# EAGLE design board (EAGLE 7.4.0)
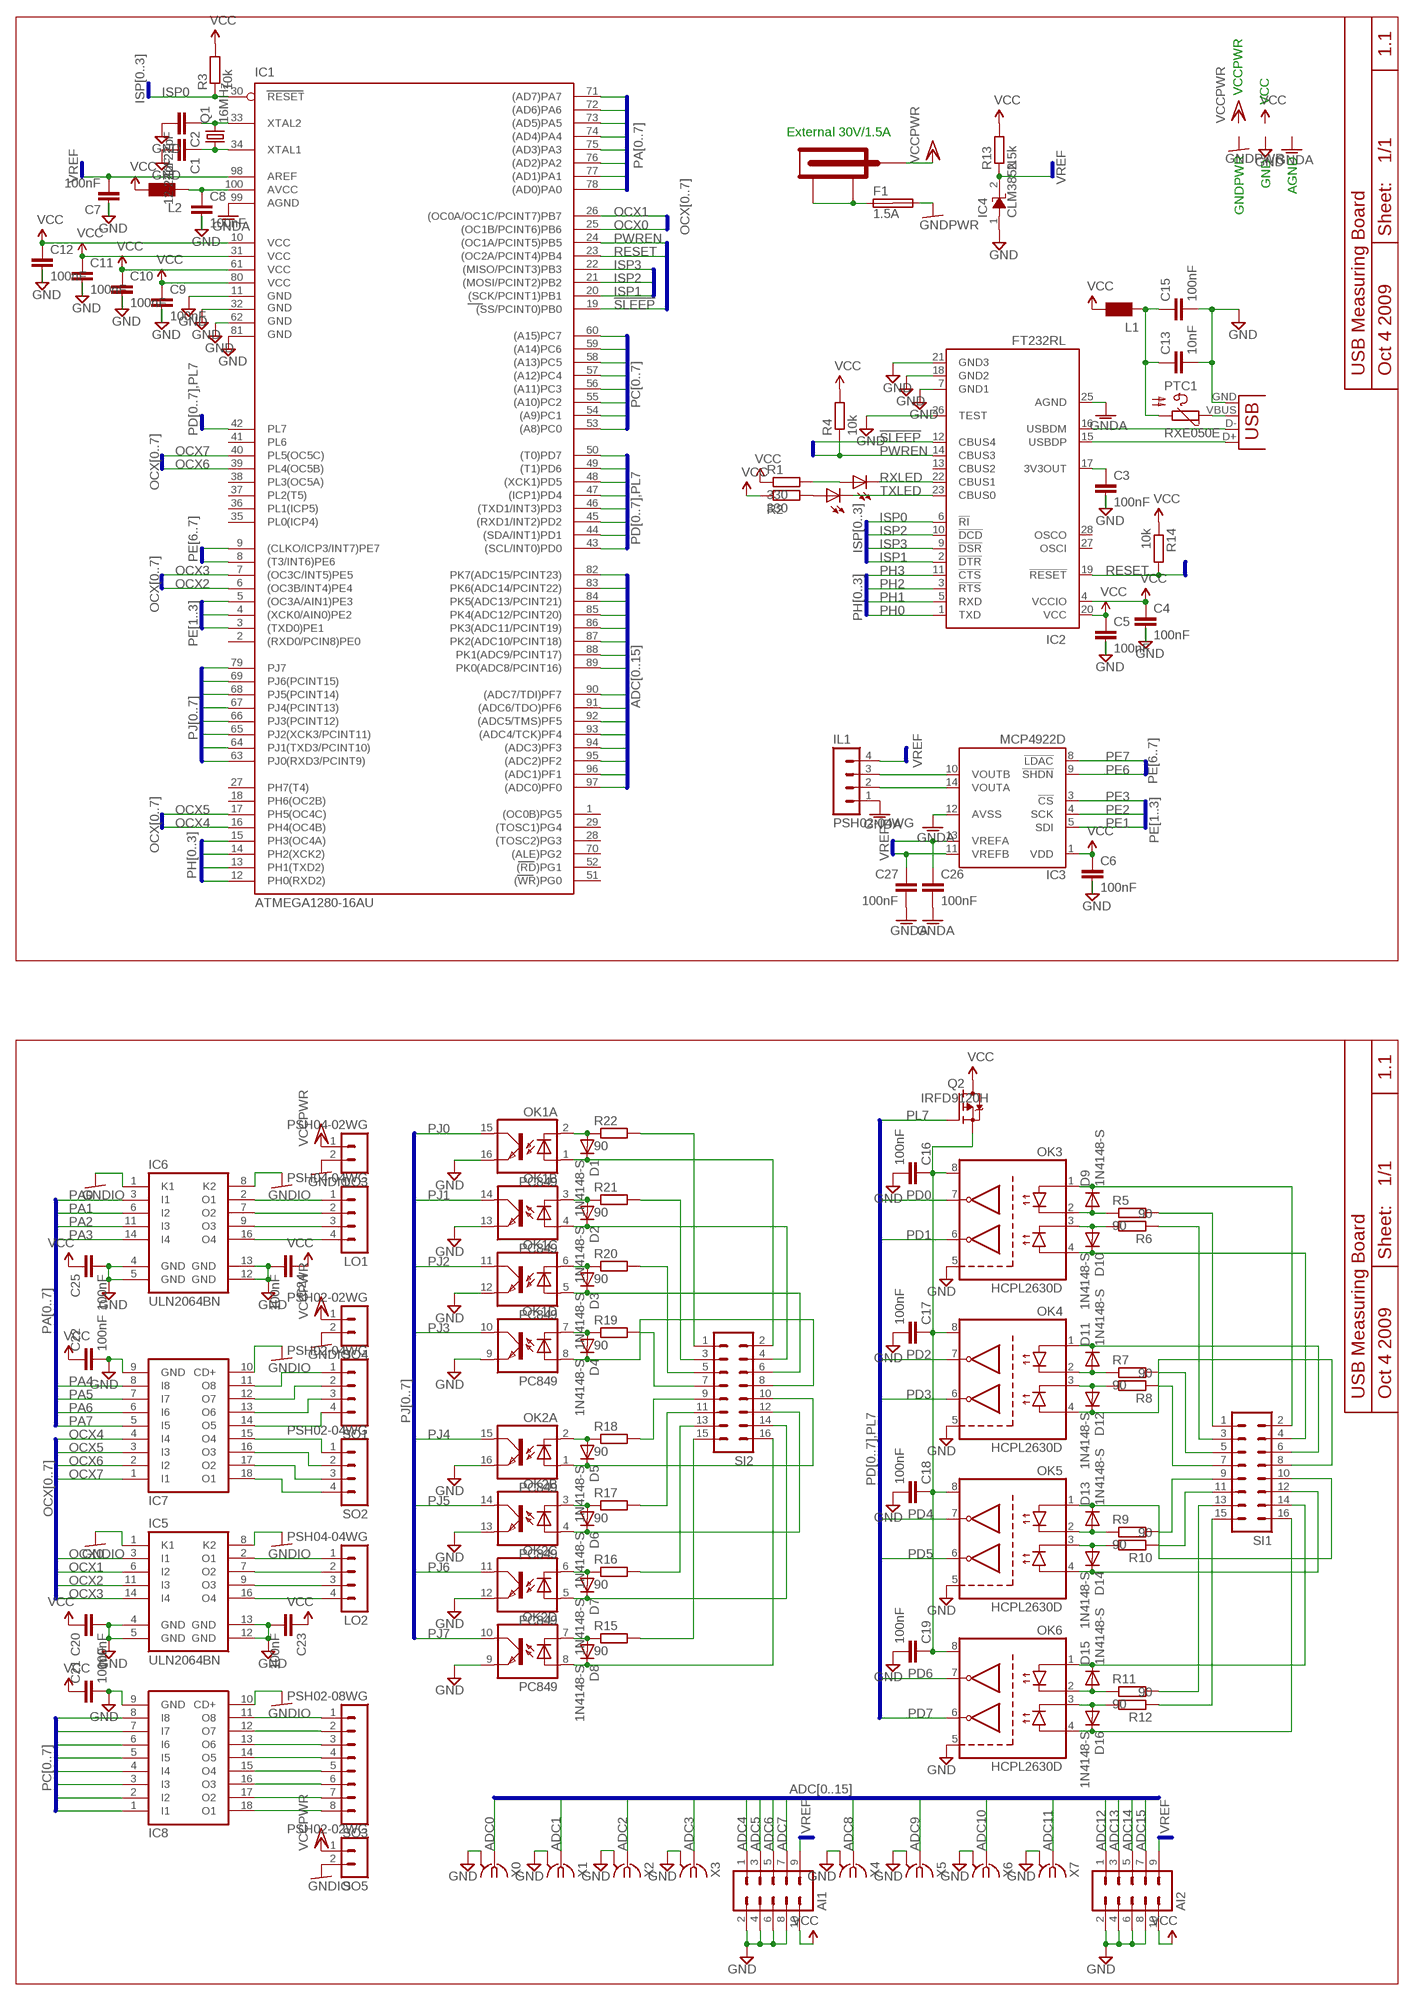
[diagram p0: schematic, sheet 1]

## Parts
AI1  ML10  [ML10]
AI2  ML10  [ML10]
C1  12-22pF  C-EUC0805K  [C0805K]
C2  12-22pF  C-EUC0805K  [C0805K]
C3  100nF  C-EUC0805K  [C0805K]
C4  100nF  C-EUC0805K  [C0805K]
C5  100nF  C-EUC0805K  [C0805K]
C6  100nF  C-EUC0805K  [C0805K]
C7  100nF  C-EUC0805K  [C0805K]
C8  100nF  C-EUC0805K  [C0805K]
C9  100nF  C-EUC0805K  [C0805K]
C10  100nF  C-EUC0805K  [C0805K]
C11  100nF  C-EUC0805K  [C0805K]
C12  100nF  C-EUC0805K  [C0805K]
C13  10nF  C-EUC0805K  [C0805K]
C15  100nF  C-EUC0805K  [C0805K]
C16  100nF  C-EUC0805K  [C0805K]
C17  100nF  C-EUC0805K  [C0805K]
C18  100nF  C-EUC0805K  [C0805K]
C19  100nF  C-EUC0805K  [C0805K]
C20  100nF  C-EUC0805K  [C0805K]
C21  100nF  C-EUC0805K  [C0805K]
C22  100nF  C-EUC0805K  [C0805K]
C23  100nF  C-EUC0805K  [C0805K]
C24  100nF  C-EUC0805K  [C0805K]
C25  100nF  C-EUC0805K  [C0805K]
C26  100nF  C-EUC0805K  [C0805K]
C27  100nF  C-EUC0805K  [C0805K]
CON1  PWR-PCB  [PWR]
D1  1N4148-S  [D0805]
D2  1N4148-S  [D0805]
D3  1N4148-S  [D0805]
D4  1N4148-S  [D0805]
D5  1N4148-S  [D0805]
D6  1N4148-S  [D0805]
D7  1N4148-S  [D0805]
D8  1N4148-S  [D0805]
D9  1N4148-S  [D0805]
D10  1N4148-S  [D0805]
D11  1N4148-S  [D0805]
D12  1N4148-S  [D0805]
D13  1N4148-S  [D0805]
D14  1N4148-S  [D0805]
D15  1N4148-S  [D0805]
D16  1N4148-S  [D0805]
F1  1.5A  FUSE-TH  [FUSE-TH]
IC1  ATMEGA1280-16AU  ATMEGA640-16AU  [TQFP100]
IC2  FT232RL  [SSOP-28]
IC3  MCP4922D  [DIL-14]
IC4  CLM385N  [TO-92]
IC5  ULN2064BN  [DIL16]
IC6  ULN2064BN  [DIL16]
IC7  ULN2803A  [DIL18]
IC8  ULN2803A  [DIL18]
IL1  PSH02-04WG  [PSH02-04WG]
L1  FB-TH  [FB-2]
L2  FB-TH  [FB-2]
LO1  PSH04-04WG  [PSH04-04WG]
LO2  PSH04-04WG  [PSH04-04WG]
LO3  PSH04-02WG  [PSH04-02WG]
OK1  PC849  [DIL-16]
OK2  PC849  [DIL-16]
OK3  HCPL2630D  [DIL-8]
OK4  HCPL2630D  [DIL-8]
OK5  HCPL2630D  [DIL-8]
OK6  HCPL2630D  [DIL-8]
PTC1  RXE050E  PTC-RXED  [RXE]
Q1  16MHz  CRYSTALHC49S  [HC49/S]
Q2  IRFD9120H  [HEXDIL-4]
R1  330  R-EU_M0805  [M0805]
R2  330  R-EU_M0805  [M0805]
R3  10k  R-EU_M0805  [M0805]
R4  10k  R-EU_M0805  [M0805]
R5  90  R-EU_M0805  [M0805]
R6  90  R-EU_M0805  [M0805]
R7  90  R-EU_M0805  [M0805]
R8  90  R-EU_M0805  [M0805]
R9  90  R-EU_M0805  [M0805]
R10  90  R-EU_M0805  [M0805]
R11  90  R-EU_M0805  [M0805]
R12  90  R-EU_M0805  [M0805]
R13  2.5k  R-EU_M0805  [M0805]
R14  10k  R-EU_M0805  [M0805]
R15  90  R-EU_M0805  [M0805]
R16  90  R-EU_M0805  [M0805]
R17  90  R-EU_M0805  [M0805]
R18  90  R-EU_M0805  [M0805]
R19  90  R-EU_M0805  [M0805]
R20  90  R-EU_M0805  [M0805]
R21  90  R-EU_M0805  [M0805]
R22  90  R-EU_M0805  [M0805]
RXLED  LED3MM  [LED3MM]
SI1  ML16  [ML16]
SI2  ML16  [ML16]
SO1  PSH02-04WG  [PSH02-04WG]
SO2  PSH02-04WG  [PSH02-04WG]
SO3  PSH02-08WG  [PSH02-08WG]
SO4  PSH02-02WG  [PSH02-02WG]
SO5  PSH02-02WG  [PSH02-02WG]
TXLED  LED3MM  [LED3MM]
USB1  USB-PTH  [USB-B-PTH]
X0  SMB-H  [SMB-H]
X1  SMB-H  [SMB-H]
X2  SMB-H  [SMB-H]
X3  SMB-H  [SMB-H]
X4  SMB-H  [SMB-H]
X5  SMB-H  [SMB-H]
X6  SMB-H  [SMB-H]
X7  SMB-H  [SMB-H]

## Nets
!SLEEP: IC1.19((SS/PCINT0)PB0) IC2.12(CBUS4)
ADC0: IC1.97((ADC0)PF0) X0.1
ADC1: IC1.96((ADC1)PF1) X1.1
ADC2: IC1.95((ADC2)PF2) X2.1
ADC3: IC1.94((ADC3)PF3) X3.1
ADC4: AI1.1 IC1.93((ADC4/TCK)PF4)
ADC5: AI1.3 IC1.92((ADC5/TMS)PF5)
ADC6: AI1.5 IC1.91((ADC6/TDO)PF6)
ADC7: AI1.7 IC1.90((ADC7/TDI)PF7)
ADC8: IC1.89(PK0(ADC8/PCINT16)) X4.1
ADC9: IC1.88(PK1(ADC9/PCINT17)) X5.1
ADC10: IC1.87(PK2(ADC10/PCINT18)) X6.1
ADC11: IC1.86(PK3(ADC11/PCINT19)) X7.1
ADC12: AI2.1 IC1.85(PK4(ADC12/PCINT20))
ADC13: AI2.3 IC1.84(PK5(ADC13/PCINT21))
ADC14: AI2.5 IC1.83(PK6(ADC14/PCINT22))
ADC15: AI2.7 IC1.82(PK7(ADC15/PCINT23))
GND: AI1.2 AI1.4 AI1.6 AI1.8 AI2.2 AI2.4 AI2.6 AI2.8 C1.2 C2.2 C3.2 C4.2 C5.2 C6.2 C7.1 C8.2 C9.2 C10.2 C11.2 C12.2 C13.2 C15.2 C16.2 C17.2 C18.2 C19.2 C20.2 C21.2 C22.2 C23.2 C24.2 C25.2 IC1.11(GND) IC1.32(GND1) IC1.62(GND2) IC1.81(GND3) IC2.7(GND1) IC2.18(GND2) IC2.21(GND3) IC2.26(TEST) IC4.1(ANO) IC5.4(GND) IC5.5(GND) IC5.12(GND) IC5.13(GND) IC6.4(GND) IC6.5(GND) IC6.12(GND) IC6.13(GND) IC7.9(GND) IC8.9(GND) OK1.9(D:EMI) OK1.12(C:EMI) OK1.13(B:EMI) OK1.16(A:EMI) OK2.9(D:EMI) OK2.12(C:EMI) OK2.13(B:EMI) OK2.16(A:EMI) OK3.5(GND) OK4.5(GND) OK5.5(GND) OK6.5(GND) USB1.GND X0.2(GND) X1.2(GND) X2.2(GND) X3.2(GND) X4.2(GND) X5.2(GND) X6.2(GND) X7.2(GND)
GNDA: C26.2 C27.2 IC1.99(AGND) IC2.25(AGND) IC3.12(AVSS) IL1.1
GNDIO: F1.2A IC5.1(K1) IC5.8(K2) IC6.1(K1) IC6.8(K2) IC7.10(CD+) IC8.10(CD+) LO3.2 SO4.2 SO5.2 ; supply symbol labelled GNDPWR
ISP0: IC1.30(RESET) IC2.6(!RI) R3.1
ISP1: IC1.20((SCK/PCINT1)PB1) IC2.2(!DTR)
ISP2: IC1.21((MOSI/PCINT2)PB2) IC2.10(!DCD)
ISP3: IC1.22((MISO/PCINT3)PB3) IC2.9(!DSR)
N$1: C1.1 IC1.34(XTAL1) Q1.1
N$2: C2.1 IC1.33(XTAL2) Q1.2
N$3: IC2.15(USBDP) USB1.D+
N$4: IC2.16(USBDM) USB1.D-
N$5: C3.1 IC2.17(3V3OUT)
N$6: R1.2 RXLED.A
N$7: R2.2 TXLED.A
N$8: C13.1 C15.1 L1.1 PTC1.2
N$9: D16.CATHODE(C) OK6.4(ANODE2) SI1.16
N$10: D15.ANODE(A) OK6.2(KATHODE1) R11.1
N$11: D14.CATHODE(C) OK5.4(ANODE2) SI1.12
N$12: D13.ANODE(A) OK5.2(KATHODE1) R9.1
N$13: D15.CATHODE(C) OK6.1(ANODE1) SI1.14
N$14: R5.2 SI1.1
N$15: D14.ANODE(A) OK5.3(KATHODE2) R10.2
N$16: D9.CATHODE(C) OK3.1(ANODE1) SI1.2
N$17: D12.CATHODE(C) OK4.4(ANODE2) SI1.8
N$18: D11.ANODE(A) OK4.2(KATHODE1) R7.1
N$19: D10.CATHODE(C) OK3.4(ANODE2) SI1.4
N$20: D9.ANODE(A) OK3.2(KATHODE1) R5.1
N$21: D4.CATHODE(C) OK1.8(D:A) SI2.8
N$22: D3.CATHODE(C) OK1.5(C:A) SI2.6
N$23: D2.CATHODE(C) OK1.4(B:A) SI2.4
N$24: D1.CATHODE(C) OK1.1(A:A) SI2.2
N$25: D8.ANODE(A) OK2.7(D:C) R15.1
N$26: D7.ANODE(A) OK2.6(C:C) R16.1
N$27: D6.ANODE(A) OK2.3(B:C) R17.1
N$28: D5.ANODE(A) OK2.2(A:C) R18.1
N$29: D5.CATHODE(C) OK2.1(A:A) SI2.10
N$30: D6.CATHODE(C) OK2.4(B:A) SI2.12
N$31: D7.CATHODE(C) OK2.5(C:A) SI2.14
N$32: D8.CATHODE(C) OK2.8(D:A) SI2.16
N$33: D4.ANODE(A) OK1.7(D:C) R19.1
N$34: D3.ANODE(A) OK1.6(C:C) R20.1
N$35: D2.ANODE(A) OK1.3(B:C) R21.1
N$36: D1.ANODE(A) OK1.2(A:C) R22.1
N$37: C8.1 IC1.100(AVCC) L2.1
N$38: R22.2 SI2.1
N$39: R21.2 SI2.3
N$40: R20.2 SI2.5
N$41: R19.2 SI2.7
N$42: R15.2 SI2.15
N$43: R16.2 SI2.13
N$44: R17.2 SI2.11
N$45: R18.2 SI2.9
N$46: R6.1 SI1.3
N$47: R7.2 SI1.5
N$48: R8.1 SI1.7
N$49: R9.2 SI1.9
N$50: R10.1 SI1.11
N$51: D11.CATHODE(C) OK4.1(ANODE1) SI1.6
N$52: R11.2 SI1.13
N$53: R12.1 SI1.15
N$54: IC8.11(O8) SO3.1
N$55: D16.ANODE(A) OK6.3(KATHODE2) R12.2
N$56: IC8.12(O7) SO3.2
N$57: IC8.13(O6) SO3.3
N$58: IC8.14(O5) SO3.4
N$59: IC8.15(O4) SO3.5
N$60: IC8.16(O3) SO3.6
N$61: IC8.17(O2) SO3.7
N$62: IC8.18(O1) SO3.8
N$63: IC7.14(O5) SO1.4
N$64: IC7.13(O6) SO1.3
N$65: IC7.12(O7) SO1.2
N$66: IC7.11(O8) SO1.1
N$67: IC5.2(O1) LO2.1
N$68: IC5.7(O2) LO2.2
N$69: IC5.9(O3) LO2.3
N$70: IC5.16(O4) LO2.4
N$71: IC6.2(O1) LO1.1
N$72: IC6.7(O2) LO1.2
N$73: IC6.9(O3) LO1.3
N$74: IC6.16(O4) LO1.4
N$75: IC7.15(O4) SO2.1
N$76: IC7.16(O3) SO2.2
N$77: IC7.17(O2) SO2.3
N$78: IC7.18(O1) SO2.4
N$79: IC3.10(VOUTB) IL1.3
N$80: IC3.14(VOUTA) IL1.2
N$81: CON1.GND1(GND) CON1.GND2(GND) F1.1A
N$83: D13.CATHODE(C) OK5.1(ANODE1) SI1.10
N$84: D12.ANODE(A) OK4.3(KATHODE2) R8.2
N$102: C16.1 C17.1 C18.1 C19.1 OK3.8(VCC) OK4.8(VCC) OK5.8(VCC) OK6.8(VCC) Q2.2(SOURCE)
N$103: PTC1.1 USB1.VBUS
N$105: D10.ANODE(A) OK3.3(KATHODE2) R6.2
OCX0: IC1.25((OC1B/PCINT6)PB6) IC5.3(I1)
OCX1: IC1.26((OC0A/OC1C/PCINT7)PB7) IC5.6(I2)
OCX2: IC1.6((OC3B/INT4)PE4) IC5.11(I3)
OCX3: IC1.7((OC3C/INT5)PE5) IC5.14(I4)
OCX4: IC1.16(PH4(OC4B)) IC7.4(I4)
OCX5: IC1.17(PH5(OC4C)) IC7.3(I3)
OCX6: IC1.39(PL4(OC5B)) IC7.2(I2)
OCX7: IC1.40(PL5(OC5C)) IC7.1(I1)
PA0: IC1.78((AD0)PA0) IC6.3(I1)
PA1: IC1.77((AD1)PA1) IC6.6(I2)
PA2: IC1.76((AD2)PA2) IC6.11(I3)
PA3: IC1.75((AD3)PA3) IC6.14(I4)
PA4: IC1.74((AD4)PA4) IC7.8(I8)
PA5: IC1.73((AD5)PA5) IC7.7(I7)
PA6: IC1.72((AD6)PA6) IC7.6(I6)
PA7: IC1.71((AD7)PA7) IC7.5(I5)
PC0: IC1.53((A8)PC0) IC8.8(I8)
PC1: IC1.54((A9)PC1) IC8.7(I7)
PC2: IC1.55((A10)PC2) IC8.6(I6)
PC3: IC1.56((A11)PC3) IC8.5(I5)
PC4: IC1.57((A12)PC4) IC8.4(I4)
PC5: IC1.58((A13)PC5) IC8.3(I3)
PC6: IC1.59((A14)PC6) IC8.2(I2)
PC7: IC1.60((A15)PC7) IC8.1(I1)
PD0: IC1.43((SCL/INT0)PD0) OK3.7(VOUT1)
PD1: IC1.44((SDA/INT1)PD1) OK3.6(VOUT2)
PD2: IC1.45((RXD1/INT2)PD2) OK4.7(VOUT1)
PD3: IC1.46((TXD1/INT3)PD3) OK4.6(VOUT2)
PD4: IC1.47((ICP1)PD4) OK5.7(VOUT1)
PD5: IC1.48((XCK1)PD5) OK5.6(VOUT2)
PD6: IC1.49((T1)PD6) OK6.7(VOUT1)
PD7: IC1.50((T0)PD7) OK6.6(VOUT2)
PE1: IC1.3((TXD0)PE1) IC3.5(SDI)
PE2: IC1.4((XCK0/AIN0)PE2) IC3.4(SCK)
PE3: IC1.5((OC3A/AIN1)PE3) IC3.3(!CS)
PE6: IC1.8((T3/INT6)PE6) IC3.9(!SHDN)
PE7: IC1.9((CLKO/ICP3/INT7)PE7) IC3.8(!LDAC)
PH0: IC1.12(PH0(RXD2)) IC2.1(TXD)
PH1: IC1.13(PH1(TXD2)) IC2.5(RXD)
PH2: IC1.14(PH2(XCK2)) IC2.3(!RTS)
PH3: IC1.15(PH3(OC4A)) IC2.11(!CTS)
PJ0: IC1.63(PJ0(RXD3/PCINT9)) OK1.15(A:COL)
PJ1: IC1.64(PJ1(TXD3/PCINT10)) OK1.14(B:COL)
PJ2: IC1.65(PJ2(XCK3/PCINT11)) OK1.11(C:COL)
PJ3: IC1.66(PJ3(PCINT12)) OK1.10(D:COL)
PJ4: IC1.67(PJ4(PCINT13)) OK2.15(A:COL)
PJ5: IC1.68(PJ5(PCINT14)) OK2.14(B:COL)
PJ6: IC1.69(PJ6(PCINT15)) OK2.11(C:COL)
PJ7: IC1.79(PJ7) OK2.10(D:COL)
PL7: IC1.42(PL7) Q2.1(GATE)
PWREN: IC1.24((OC1A/PCINT5)PB5) IC2.14(CBUS3) R4.1
RESET: IC1.23((OC2A/PCINT4)PB4) IC2.19(!RESET) R14.2
RXLED: IC2.22(CBUS1) RXLED.K(C)
TXLED: IC2.23(CBUS0) TXLED.K(C)
VCC: AI1.10 AI2.10 C4.1 C5.1 C6.1 C9.1 C10.1 C11.1 C12.1 C20.1 C21.1 C22.1 C23.1 C24.1 C25.1 IC1.10(VCC) IC1.31(VCC1) IC1.61(VCC2) IC1.80(VCC3) IC2.4(VCCIO) IC2.20(VCC) IC3.1(VDD) L1.2 L2.2 Q2.3(DRAIN) R1.1 R2.1 R3.2 R4.2 R13.2 R14.1
VCC/2: CON1.VCC(+VCC) LO3.1 SO4.1 SO5.1 ; supply symbol labelled VCCPWR
VREF: AI1.9 AI2.9 C7.2 C26.1 C27.1 IC1.98(AREF) IC3.11(VREFB) IC3.13(VREFA) IC4.2(CAT) IL1.4 R13.1
Unconnected: F1.1B F1.2B IC1.1((OC0B)PG5) IC1.2((RXD0/PCIN8)PE0) IC1.18(PH6(OC2B)) IC1.27(PH7(T4)) IC1.28((TOSC2)PG3) IC1.29((TOSC1)PG4) IC1.35(PL0(ICP4)) IC1.36(PL1(ICP5)) IC1.37(PL2(T5)) IC1.38(PL3(OC5A)) IC1.41(PL6) IC1.51((WR)PG0) IC1.52((RD)PG1) IC1.70((ALE)PG2) IC2.13(CBUS2) IC2.27(OSCI) IC2.28(OSCO)

## Buses
PH[0..3]
ISP[0..3]
PA[0..7]
PD[0..7],PL7
OCX[0..7]
PE[1..3]
PE[6..7]
PWREN,RESET,!SLEEP
PJ[0..7]
PC[0..7]
ADC[0..15]
VREF

## Notes on the sheet
- VCCPWR
- VCC
- External 30V/1.5A
- GNDPWR | AGND
- GND

## Power pins joined to a net without a drawn wire
GND: X0.3(GND) X0.4(GND) X0.5(GND) X1.3(GND) X1.4(GND) X1.5(GND) X2.3(GND) X2.4(GND) X2.5(GND) X3.3(GND) X3.4(GND) X3.5(GND) X4.3(GND) X4.4(GND) X4.5(GND) X5.3(GND) X5.4(GND) X5.5(GND) X6.3(GND) X6.4(GND) X6.5(GND) X7.3(GND) X7.4(GND) X7.5(GND)

## Library data of the parts
AI1 AI2 = con-harting-ml:ML10: HARTING
C1-C13 C15-C27 = resistor:C-EU: CAPACITOR, European symbol
CON1 = connectors:PWR: PCB Power Connector
D1-D16 = ic:1N4148: Diode 1N4148 75V, 150mA
F1 = connectors:FUSE: Fuse Socket 5 x 20/6 x 32 mm
IC1 = atmegaX0:ATMEGA*: MICROCONTROLLER 64/128/256 Kbytes FLASH 4 Kbytes EEPROM 8 Kbytes SRAM 86 General Purpose I/O pins 12-channels16-bit PWM 4 x Serial USARTs 16-channels 10-bit A/D
IC2 = ftdi:FT232R: FTDI - FT232R USB-UART Wraper The FT232R is the latest device to be added to FTDI?s range of USB UART interface Integrated Circuit Devices. The FT232R is a USB to serial UART interface with optional clock generator output, and the new FTDIChip-ID? security dongle feature. In addition, asynchronous and synchronous bit bang interface modes are available. USB to serial designs using the FT232R have been further simplified by fully integrating the external EEPROM, clock circuit and USB resistors onto the device. The FT232R adds two new functions compared with its predecessors, effectively making it a "3-in-1" chip for some application areas. The internally generated clock (6MHz, 12MHz, 24MHz, and 48MHz) can be brought out of the device and used to drive a microcontroller or external logic. A unique number (the FTDIChip-ID?) is burnt into the device during manufacture and is readable over USB, thus forming the basis of a security dongle which can be used to protect customer application software from being copied. The FT232R is available in Pb-free (RoHS compliant) compact 28-Lead SSOP and QFN-32 packages. To find out more about the FT232R, goto http://ftdichip.com/Products/FT232R.htm.
IC3 = dac:MCP4922: Microchip MCP4922 Dual 12-Bit DAC with SPI interface
IC4 = ic:CLM385: Voltage Reference Diode 2.5V CLM285-2.5 CLM385-2.5
IC5 IC6 = uln-udn:ULN2064B: DRIVER ARRAY
IC7 IC8 = uln-udn:ULN2803A: DRIVER ARRAY
IL1 SO1 SO2 = con-usb:PSH02-04: PSH02-04 Male Connector
L1 L2 = ic:FB: EMI Suppression Ferrite Bead
LO1 LO2 = con-usb:PSH04-04: PSH02-04 Male Connector
LO3 = con-usb:PSH04-02: PSH02-02 Male Connector
OK1 OK2 = ic:PC849: Sharp Quad Optocoupler PC849 Fixed from original optocoupler library from Cadsoft. Some pin connections swapped.
OK3-OK6 = ic:HCPL2630: High CMR, High Speed TTL Compatible optocuplers Hewlett-Packard HCPL-2630 HCPL-2631
PTC1 = ic:PTC-RXE: ECE PTC Postivie Temperature Coefficient Poly Switch Resettable Fuse. ECE RXE0xxE models
Q1 = crystal:CRYSTAL: CRYSTAL
Q2 = ic:IRFD9120: P Level MOSFET Small-Signal-Transistor P-Channel, Enhancement mode, TTL and CMOS Logic Levels
R1-R22 = resistor:R-EU_: RESISTOR, European symbol
RXLED TXLED = led:LED: LED OSRAM: - CHIPLED LG R971, LG N971, LY N971, LG Q971, LY Q971, LO R971, LY R971 LH N974, LH R974 LS Q976, LO Q976, LY Q976 LO Q996 - Hyper CHIPLED LW Q18S LB Q993, LB Q99A, LB R99A - SideLED LS A670, LO A670, LY A670, LG A670, LP A670 LB A673, LV A673, LT A673, LW A673 LH A674 LY A675 LS A676, LA A676, LO A676, LY A676, LW A676 LS A679, LY A679, LG A679 - Hyper Micro SIDELED® LS Y876, LA Y876, LO Y876, LY Y876 LT Y87S - SmartLED LW L88C, LW L88S LB L89C, LB L89S, LG L890 LS L89K, LO L89K, LY L89K LS L896, LA L896, LO L896, LY L896 - TOPLED LS T670, LO T670, LY T670, LG T670, LP T670 LSG T670, LSP T670, LSY T670, LOP T670, LYG T670 LG T671, LOG T671, LSG T671 LB T673, LV T673, LT T673, LW T673 LH T674 LS T676, LA T676, LO T676, LY T676, LB T676, LH T676, LSB T676, LW T676 LB T67C, LV T67C, LT T67C, LS T67K, LO T67K, LY T67K, LW E67C LS E67B, LA E67B, LO E67B, LY E67B, LB E67C, LV E67C, LT E67C LW T67C LS T679, LY T679, LG T679 LS T770, LO T770, LY T770, LG T770, LP T770 LB T773, LV T773, LT T773, LW T773 LH T774 LS E675, LA E675, LY E675, LS T675 LS T776, LA T776, LO T776, LY T776, LB T776 LHGB T686 LT T68C, LB T68C - Hyper Mini TOPLED® LB M676 - Mini TOPLED Santana® LG M470 LS M47K, LO M47K, LY M47K Source: http://www.osram.convergy.de LUXEON: - LUMILED® LXK2-PW12-R00, LXK2-PW12-S00, LXK2-PW14-U00, LXK2-PW14-V00 LXK2-PM12-R00, LXK2-PM12-S00, LXK2-PM14-U00 LXK2-PE12-Q00, LXK2-PE12-R00, LXK2-PE12-S00, LXK2-PE14-T00, LXK2-PE14-U00 LXK2-PB12-K00, LXK2-PB12-L00, LXK2-PB12-M00, LXK2-PB14-N00, LXK2-PB14-P00, LXK2-PB14-Q00 LXK2-PR12-L00, LXK2-PR12-M00, LXK2-PR14-Q00, LXK2-PR14-R00 LXK2-PD12-Q00, LXK2-PD12-R00, LXK2-PD12-S00 LXK2-PH12-R00, LXK2-PH12-S00 LXK2-PL12-P00, LXK2-PL12-Q00, LXK2-PL12-R00 Source: www.luxeon.com KINGBRIGHT: KA-3528ASYC Source: www.kingbright.com
SI1 SI2 = con-harting-ml:ML16: HARTING
SO3 = con-usb:PSH02-08: PSH02-04 Male Connector
SO4 SO5 = con-usb:PSH02-02: PSH02-02 Male Connector
USB1 = con-usb:USB: USB Connectors USB-B-PTH is fully proven SKU : PRT-00139 USB-miniB is fully proven SKU : PRT-00587 USB-A-PCB is untested. USB-A-H is throughly reviewed, but untested. Spark Fun Electronics SKU : PRT-00437 USB-B-SMT is throughly reviewed, but untested. Needs silkscreen touching up. USB-A-S has not been used/tested USB-MB-H has not been used/tested
X0 X1-X7 = connectors:SMB-H: FEMALE SMB CONNECTOR Radiall

## Net classes
0 default: width 0.254 mm

## Board
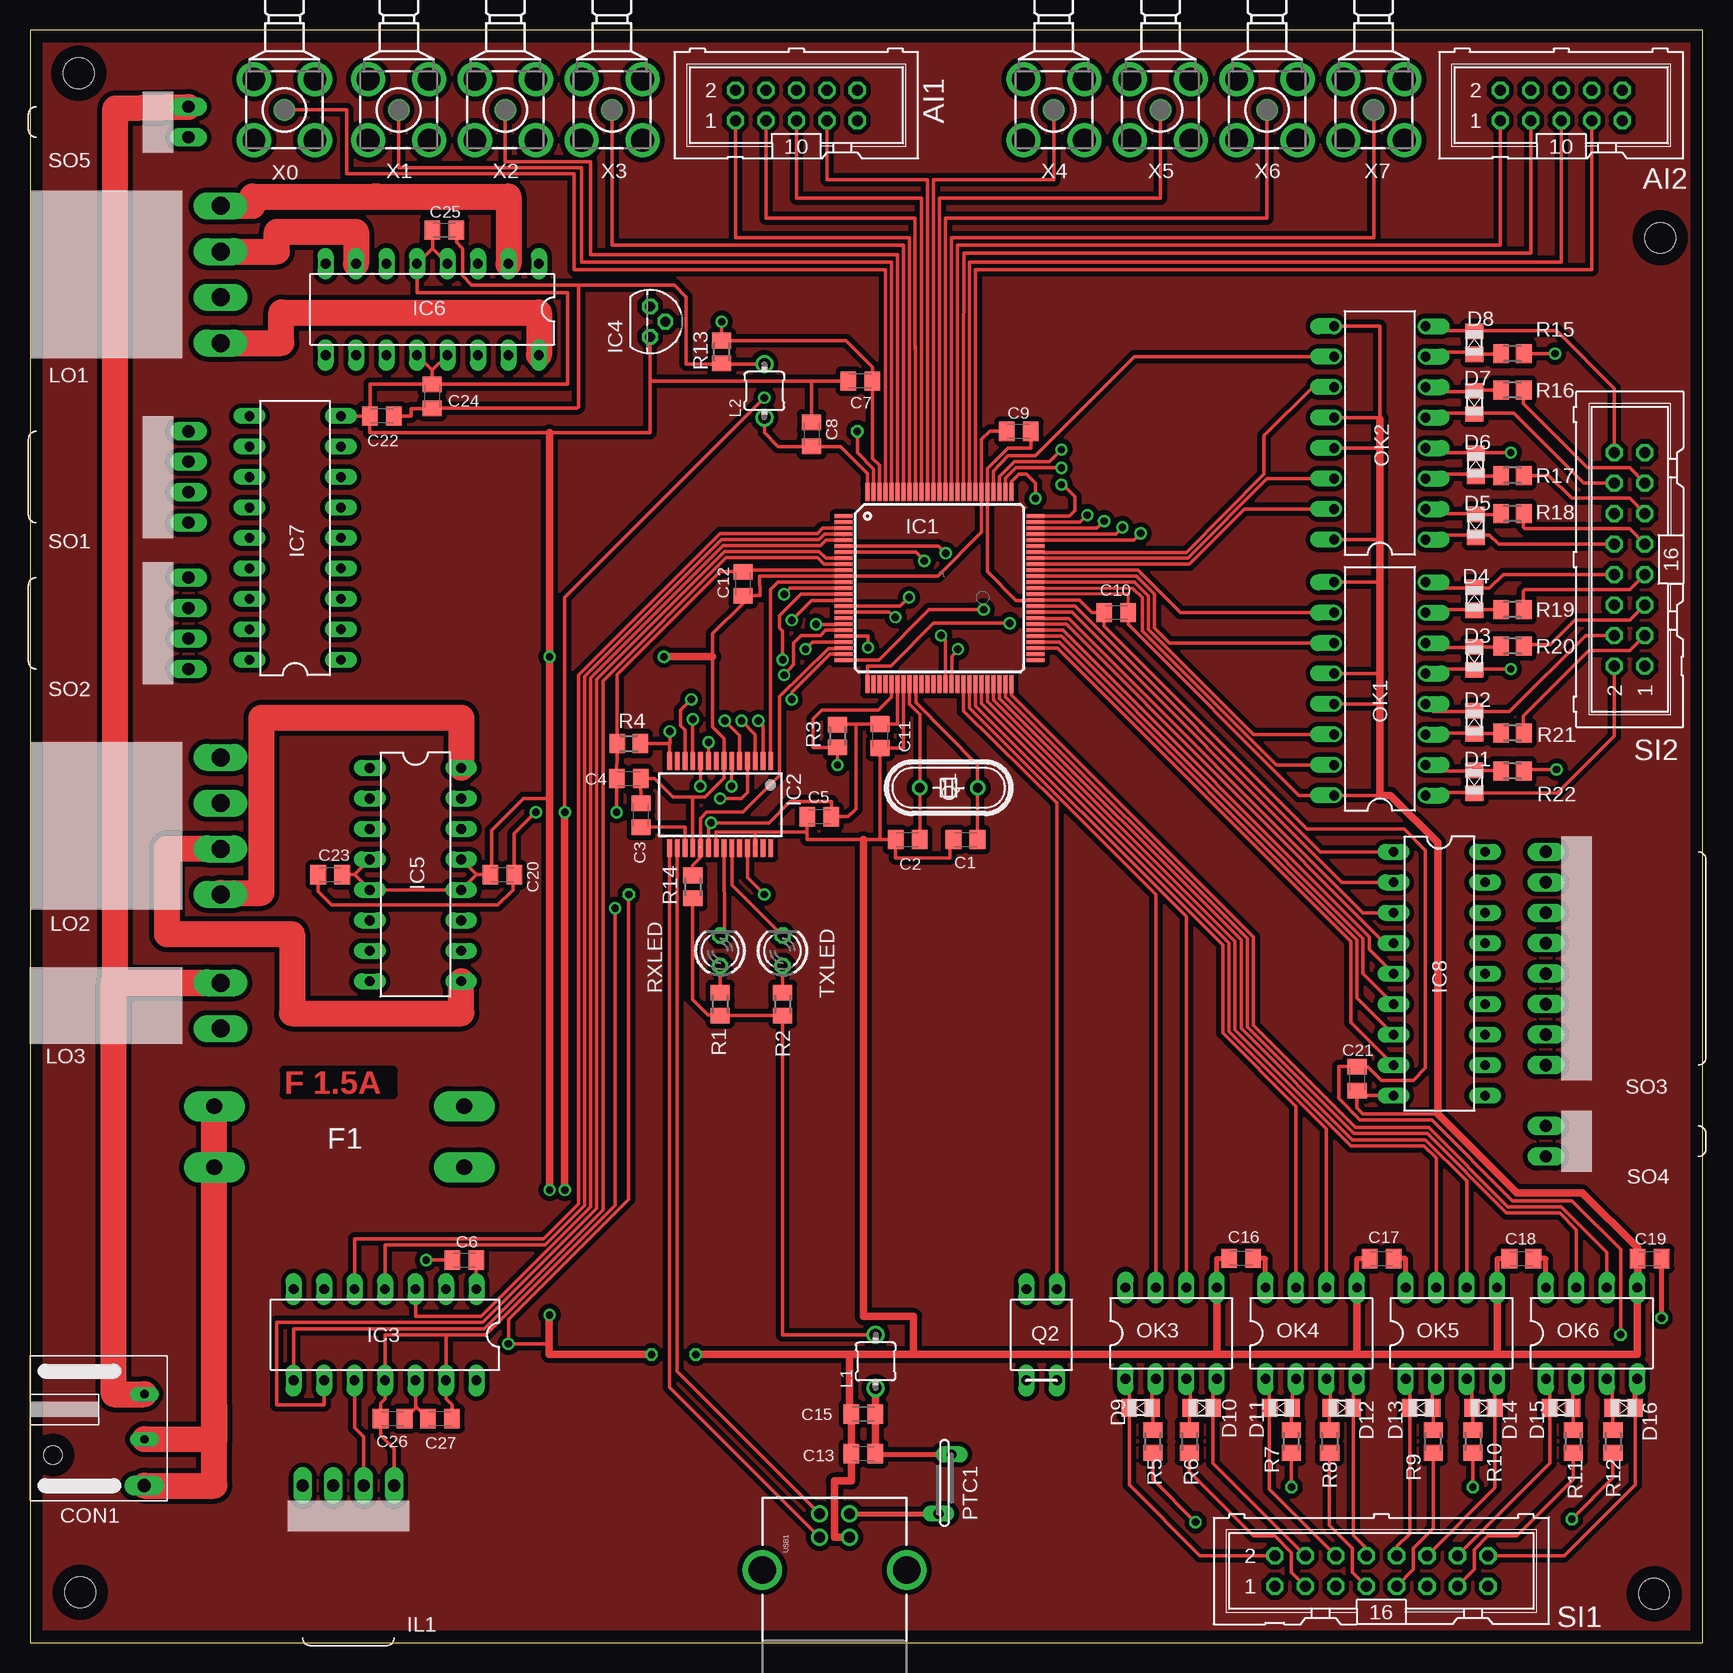
[diagram p1: board, top side]
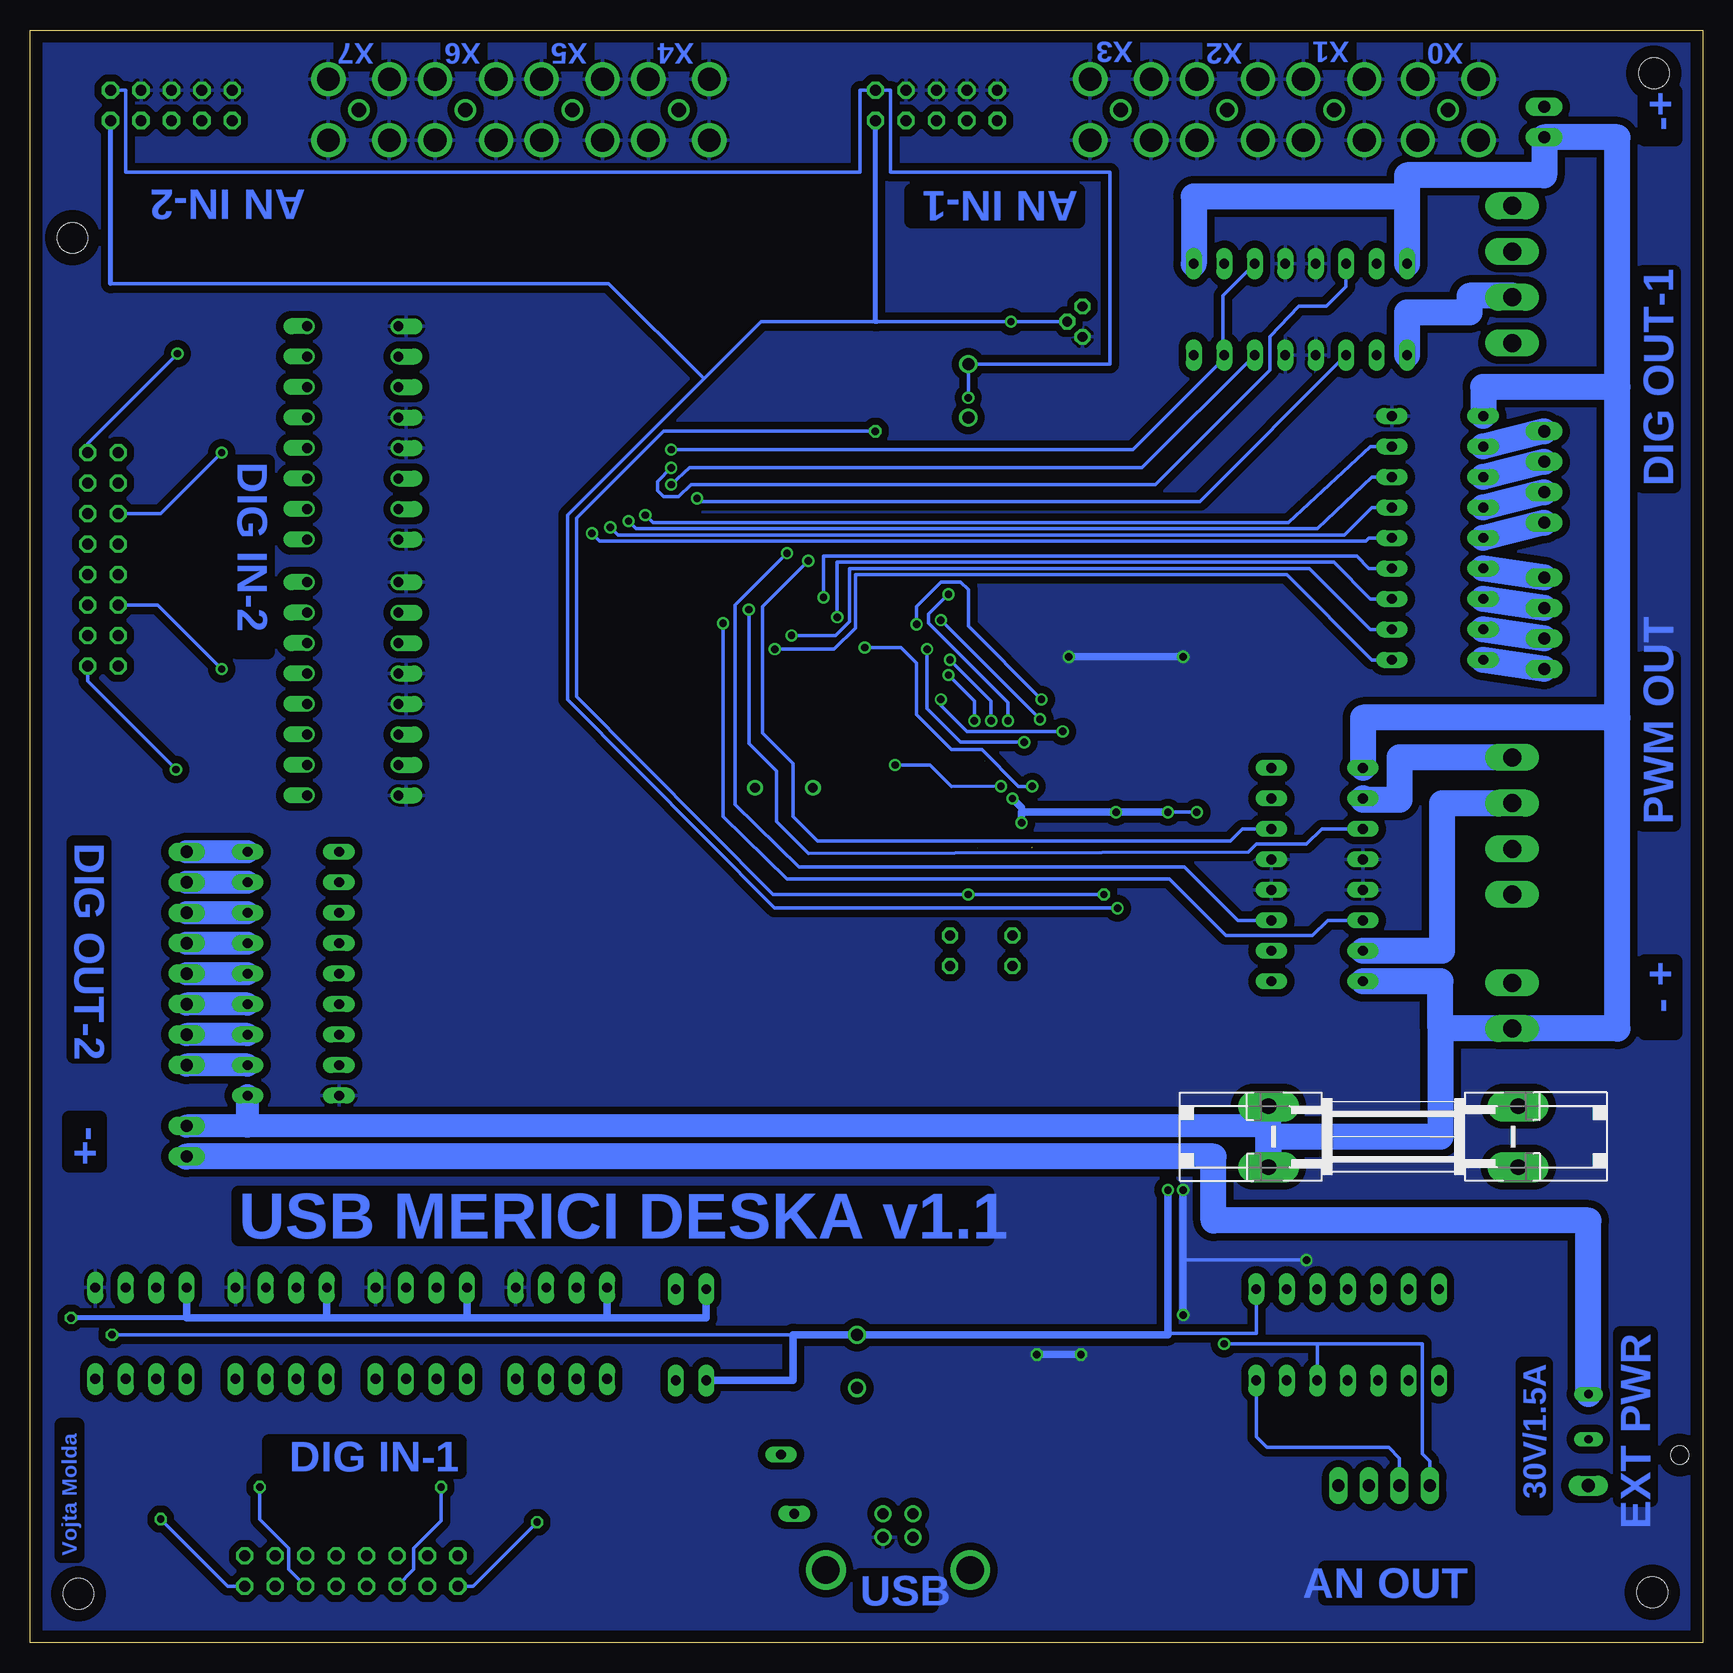
[diagram p2: board, bottom side, seen from below]

Size 139.43 x 134.42 mm. Coordinates in mm from the lower left corner, seen from the top.
Outline: 0,0 139.43,0 139.43,134.42 0,134.42 0,0
Copper layers (1*16): Top 0.035mm / dielectric 1.5mm / Bottom 0.035mm
Design rules "default *": minimum track width 10mil, minimum drill 24mil, track to track 5mil, track to pad 3mil, pad to pad 3mil, via to via 8mil, smd to smd 8mil, copper to edge 40mil, drill to drill 8mil, minimum pad ring 10mil, minimum via ring 8mil, stop-mask expansion 4mil, vias tented up to drill 0mil, thermal gap 10mil
Holes 2.54 mm at 135.38,4.06 4.19,4.19 135.89,117.09 4.06,130.81

### Footprints (pad centres in the part's own frame; a part is rotated, then mirrored left to right if it is on the bottom)
ML10 = drill 0.914 octagon: 1 -5.08,-1.27; 2 -5.08,1.27; 3 -2.54,-1.27; 4 -2.54,1.27; 5 0,-1.27; 6 0,1.27; 7 2.54,-1.27; 8 2.54,1.27; 9 5.08,-1.27; 10 5.08,1.27
C0805K = smd 1.3 x 1.6: 1 -1,0; 2 1,0
PWR = drill 0.7 long: GND1 2.54,1.321; VCC 2.54,5.08 | drill 1.1 long: GND2 2.54,-2.54 | hole 1.524: -5.08,0
D0805 = smd 1.3 x 1.5: ANODE -0.95,0; CATHODE 0.95,0
FUSE-TH = drill 1.321 pad 2.54 long: 1A -10.414,2.54; 1B -10.414,-2.54; 2A 10.414,2.54; 2B 10.414,-2.54
TQFP100 = smd 1.5 x 0.35: 1 -8,6; 2 -8,5.5; 3 -8,5; 4 -8,4.5; 5 -8,4; 6 -8,3.5; 7 -8,3; 8 -8,2.5; 9 -8,2; 10 -8,1.5; 11 -8,1; 12 -8,0.5; 13 -8,0; 14 -8,-0.5; 15 -8,-1; 16 -8,-1.5; 17 -8,-2; 18 -8,-2.5; 19 -8,-3; 20 -8,-3.5; 21 -8,-4; 22 -8,-4.5; 23 -8,-5; 24 -8,-5.5; 25 -8,-6; 51 8,-6; 52 8,-5.5; 53 8,-5; 54 8,-4.5; 55 8,-4; 56 8,-3.5; 57 8,-3; 58 8,-2.5; 59 8,-2; 60 8,-1.5; 61 8,-1; 62 8,-0.5; 63 8,0; 64 8,0.5; 65 8,1; 66 8,1.5; 67 8,2; 68 8,2.5; 69 8,3; 70 8,3.5; 71 8,4; 72 8,4.5; 73 8,5; 74 8,5.5; 75 8,6 | smd 0.35 x 1.5: 26 -6,-8; 27 -5.5,-8; 28 -5,-8; 29 -4.5,-8; 30 -4,-8; 31 -3.5,-8; 32 -3,-8; 33 -2.5,-8; 34 -2,-8; 35 -1.5,-8; 36 -1,-8; 37 -0.5,-8; 38 0,-8; 39 0.5,-8; 40 1,-8; 41 1.5,-8; 42 2,-8; 43 2.5,-8; 44 3,-8; 45 3.5,-8; 46 4,-8; 47 4.5,-8; 48 5,-8; 49 5.5,-8; 50 6,-8; 76 6,8; 77 5.5,8; 78 5,8; 79 4.5,8; 80 4,8; 81 3.5,8; 82 3,8; 83 2.5,8; 84 2,8; 85 1.5,8; 86 1,8; 87 0.5,8; 88 0,8; 89 -0.5,8; 90 -1,8; 91 -1.5,8; 92 -2,8; 93 -2.5,8; 94 -3,8; 95 -3.5,8; 96 -4,8; 97 -4.5,8; 98 -5,8; 99 -5.5,8; 100 -6,8
SSOP-28 = smd 0.4 x 1.5: 1 -4.225,-3.625; 2 -3.575,-3.625; 3 -2.925,-3.625; 4 -2.275,-3.625; 5 -1.625,-3.625; 6 -0.975,-3.625; 7 -0.325,-3.625; 8 0.325,-3.625; 9 0.975,-3.625; 10 1.625,-3.625; 11 2.275,-3.625; 12 2.925,-3.625; 13 3.575,-3.625; 14 4.225,-3.625; 15 4.225,3.625; 16 3.575,3.625; 17 2.925,3.625; 18 2.275,3.625; 19 1.625,3.625; 20 0.975,3.625; 21 0.325,3.625; 22 -0.325,3.625; 23 -0.975,3.625; 24 -1.625,3.625; 25 -2.275,3.625; 26 -2.925,3.625; 27 -3.575,3.625; 28 -4.225,3.625
DIL-14 = drill 0.813 long: 1 -7.62,-3.81; 2 -5.08,-3.81; 3 -2.54,-3.81; 4 0,-3.81; 5 2.54,-3.81; 6 5.08,-3.81; 7 7.62,-3.81; 8 7.62,3.81; 9 5.08,3.81; 10 2.54,3.81; 11 0,3.81; 12 -2.54,3.81; 13 -5.08,3.81; 14 -7.62,3.81
TO-92 = drill 0.813 octagon: 1 -1.27,1.27; 2 0,0; 3 1.27,1.27
DIL16 = drill 0.813 long: 1 -8.89,-3.81; 2 -6.35,-3.81; 3 -3.81,-3.81; 4 -1.27,-3.81; 5 1.27,-3.81; 6 3.81,-3.81; 7 6.35,-3.81; 8 8.89,-3.81; 9 8.89,3.81; 10 6.35,3.81; 11 3.81,3.81; 12 1.27,3.81; 13 -1.27,3.81; 14 -3.81,3.81; 15 -6.35,3.81; 16 -8.89,3.81
DIL18 = drill 0.813 long: 1 -10.16,-3.81; 2 -7.62,-3.81; 3 -5.08,-3.81; 4 -2.54,-3.81; 5 0,-3.81; 6 2.54,-3.81; 7 5.08,-3.81; 8 7.62,-3.81; 9 10.16,-3.81; 10 10.16,3.81; 11 7.62,3.81; 12 5.08,3.81; 13 2.54,3.81; 14 0,3.81; 15 -2.54,3.81; 16 -5.08,3.81; 17 -7.62,3.81; 18 -10.16,3.81
PSH02-04WG = drill 1.016 long: 1 -3.81,2.54; 2 -1.27,2.54; 3 1.27,2.54; 4 3.81,2.54
FB-2 = drill 1 round: 1 -2.54,0; 2 1.905,0
PSH04-04WG = drill 1.5 long: 1 -5.08,3.81; 2 -1.27,3.81; 3 2.54,3.81; 4 6.35,3.81
PSH04-02WG = drill 1.5 long: 1 -1.27,2.54; 2 2.54,2.54
DIL-16 = drill 0.813 offset: 1 -7.62,-3.81; 2 -5.08,-3.81; 3 -2.54,-3.81; 4 0,-3.81; 5 2.54,-3.81; 6 5.08,-3.81; 7 7.62,-3.81; 8 10.16,-3.81; 9 10.16,3.81; 10 7.62,3.81; 11 5.08,3.81; 12 2.54,3.81; 13 0,3.81; 14 -2.54,3.81; 15 -5.08,3.81; 16 -7.62,3.81
DIL-8 = drill 0.813 long: 1 -3.81,-3.81; 2 -1.27,-3.81; 3 1.27,-3.81; 4 3.81,-3.81; 5 3.81,3.81; 6 1.27,3.81; 7 -1.27,3.81; 8 -3.81,3.81
RXE = drill 0.813 long: 1 -1.97,0.6; 2 2.97,-0.5
HC49/S = drill 0.813 round: 1 -2.413,0; 2 2.413,0
HEXDIL-4 = drill 0.813 long: 1 -1.27,-3.81; 2 1.27,-3.81; 3 1.27,3.81; 4 -1.27,3.81
M0805 = smd 1.3 x 1.6: 1 -0.95,0; 2 0.95,0
LED3MM = drill 0.813 octagon: A -1.27,0; K 1.27,0
ML16 = drill 0.914 octagon: 1 -8.89,-1.27; 2 -8.89,1.27; 3 -6.35,-1.27; 4 -6.35,1.27; 5 -3.81,-1.27; 6 -3.81,1.27; 7 -1.27,-1.27; 8 -1.27,1.27; 9 1.27,-1.27; 10 1.27,1.27; 11 3.81,-1.27; 12 3.81,1.27; 13 6.35,-1.27; 14 6.35,1.27; 15 8.89,-1.27; 16 8.89,1.27
PSH02-08WG = drill 1.016 long: 1 -8.89,2.54; 2 -6.35,2.54; 3 -3.81,2.54; 4 -1.27,2.54; 5 1.27,2.54; 6 3.81,2.54; 7 6.35,2.54; 8 8.89,2.54
PSH02-02WG = drill 1.016 long: 1 -1.27,1.27; 2 1.27,1.27
USB-B-PTH = drill 0.914 round: D+ 0,1.25; D- 1.981,1.25; GND 0,-1.25; VBUS 1.981,-1.25 | drill 2.286 round: P$1 -2.718,-6.02; P$2 -2.718,6.02
SMB-H = drill 1.2 round: 1 0,0 | drill 1.9 round: 2 -2.54,2.54; 3 2.54,2.54; 4 2.54,-2.54; 5 -2.54,-2.54

### Placement (x,y rotation side)
AI1  63.88,128.14 0 top
AI2  127.64,128.14 0 top
C1  77.98,66.93 180 top
C2  73.15,66.93 180 top
C3  50.93,68.96 90 top
C4  49.91,72.01 0 top
C5  65.79,68.83 180 top
C6  36.19,31.88 180 top
C7  69.21,105.16 0 top
C8  65.15,100.71 90 top
C9  82.42,100.96 180 top
C10  90.55,85.85 0 top
C11  70.87,75.56 270 top
C12  59.44,88.27 270 top
C13  69.47,15.75 180 top
C15  69.47,19.05 180 top
C16  100.96,32.03 180 top
C17  112.66,32 180 top
C18  124.31,32 180 top
C19  135,32 180 top
C20  39.37,64.01 180 top
C21  110.62,46.99 270 top
C22  29.34,102.23 180 top
C23  25.02,64.01 0 top
C24  33.53,103.89 90 top
C25  34.54,117.73 180 top
C26  30.23,18.67 0 top
C27  34.16,18.67 180 top
CON1  6.98,15.62 0 top
D1  120.4,71.75 270 top
D2  120.4,76.71 90 top
D3  120.4,82.04 270 top
D4  120.4,86.99 90 top
D5  120.52,93.09 270 top
D6  120.52,98.17 90 top
D7  120.4,103.38 270 top
D8  120.4,108.33 90 top
D9  92.58,19.56 180 top
D10  97.66,19.56 0 top
D11  104.27,19.56 180 top
D12  109.35,19.56 0 top
D13  115.95,19.56 180 top
D14  121.16,19.56 0 top
D15  127.64,19.56 180 top
D16  132.84,19.56 0 top
F1  25.78,42.16 180 bottom
IC1  75.82,87.88 0 top
IC2  57.53,69.85 180 top
IC3  29.59,25.65 180 top
IC4  52.96,110.11 90 top
IC5  32.13,64.01 270 top
IC6  33.53,111.12 180 top
IC7  22.1,92.08 90 top
IC8  117.48,55.75 270 top
IL1  26.54,10.54 0 top
L1  70.48,23.75 90 top
L2  61.21,104.65 90 top
LO1  12.06,114.68 270 top
LO2  12.06,68.71 270 top
LO3  13.33,53.72 270 top
OK1  112.52,78.23 90 top
OK2  112.52,99.57 90 top
OK3  95.12,25.78 0 top
OK4  106.81,25.78 0 top
OK5  118.49,25.78 0 top
OK6  130.18,25.78 0 top
PTC1  76.33,12.7 90 top
Q1  76.58,71.25 180 top
Q2  84.33,25.65 180 top
R1  57.53,53.21 90 top
R2  62.74,53.21 90 top
R3  67.31,75.56 90 top
R4  49.91,74.93 180 top
R5  93.6,16.76 270 top
R6  96.65,16.76 90 top
R7  105.16,16.76 270 top
R8  108.33,16.76 90 top
R9  116.97,16.76 270 top
R10  120.27,16.76 90 top
R11  128.65,16.76 270 top
R12  131.95,16.76 90 top
R13  57.66,107.57 270 top
R14  55.24,62.99 90 top
R15  123.57,107.44 0 top
R16  123.57,104.39 0 top
R17  123.57,97.28 0 top
R18  123.57,94.11 0 top
R19  123.57,86.11 0 top
R20  123.57,83.06 0 top
R21  123.57,75.82 0 top
R22  123.57,72.64 0 top
RXLED  57.53,57.66 90 top
SI1  112.65,5.97 0 top
SI2  133.35,90.3 90 top
SO1  10.67,97.16 270 top
SO2  10.67,84.96 270 top
SO3  128.9,57.02 90 top
SO4  127.64,41.78 90 top
SO5  11.94,126.75 270 top
TXLED  62.74,57.66 90 top
USB1  67.06,8.76 90 top
X0  21.21,127.76 90 top
X1  30.73,127.76 90 top
X2  39.62,127.76 90 top
X3  48.51,127.76 90 top
X4  85.34,127.76 90 top
X5  94.23,127.76 90 top
X6  103.12,127.76 90 top
X7  112.01,127.76 90 top

### Tracks (layer width: path | path; a pad name or v marks a point on that pad's centre or on a via)
!SLEEP  (via drill 0.61)
  Top 0.305: v65.52,84.87 67.93,84.87 IC1.19 | v55.12,78.61 54.23,77.72 54.23,76.45 54.61,76.07 IC2.12
  Bottom 0.305: v65.52,84.87 65.53,86.36 63.5,88.39 61.85,88.39 61.21,87.76 61.21,84.71 v55.12,78.61
ADC0
  Top 0.305: 28.7,122.43 45.34,122.43 45.34,114.43 71.32,114.43 IC1.97 | 28.7,122.43 27.3,122.43 | X0.1 26.42,127.76 26.42,122.43 28.7,122.43
ADC1
  Top 0.305: IC1.96 71.82,96.39 71.82,96.37 71.82,115.06 45.97,115.06 45.97,122.94 30.73,122.94 X1.1
ADC2
  Top 0.305: IC1.95 72.32,115.7 46.74,115.7 46.74,123.44 39.62,123.44 X2.1
ADC3
  Top 0.305: X3.1 48.51,116.46 72.82,116.46 72.82,96.39 IC1.94
ADC4
  Top 0.305: AI1.1 58.8,117.09 73.32,117.09 IC1.93
ADC5
  Top 0.305: 73.82,107.82 73.82,108.08 | 73.82,107.82 IC1.92 | AI1.3 61.34,118.74 73.79,118.74 73.79,107.82 73.82,107.82
ADC6
  Top 0.305: IC1.91 74.3,108.71 74.3,120.4 63.88,120.4 AI1.5
ADC7
  Top 0.305: IC1.90 74.82,95.5 74.8,95.5 74.8,108.2 | 74.8,108.2 74.8,109.22 | AI1.7 66.42,121.92 74.8,121.92 74.8,108.2
ADC8
  Top 0.305: X4.1 85.34,121.92 75.32,121.92 IC1.89
ADC9
  Top 0.305: X5.1 94.23,120.4 75.82,120.4 IC1.88
ADC10
  Top 0.305: X6.1 103.12,118.74 76.32,118.74 IC1.87
ADC11
  Top 0.305: 76.82,106.3 76.82,107.31 | 76.82,106.3 IC1.86 | X7.1 112.01,117.09 76.82,117.09 76.82,106.3
ADC12
  Top 0.305: AI2.1 122.55,116.46 77.32,116.46 IC1.85
ADC13
  Top 0.305: 77.82,105.79 77.82,105.92 | 77.82,105.79 IC1.84 | AI2.3 125.09,115.82 77.85,115.82 77.8,105.79 77.82,105.79
ADC14
  Top 0.305: 127.64,123.95 127.64,123.57 | 127.64,123.95 AI2.5 | IC1.83 78.32,115.06 127.64,115.06 127.64,123.95
ADC15
  Top 0.305: 78.82,103.5 78.82,104.52 | 78.82,103.5 IC1.82 | AI2.7 130.18,114.43 78.82,114.43 78.82,103.5
CU
  pour Top (isolate 0.406): 139.32,134.24 139.32,0.13 0.13,0.13 0.13,134.24
GND  (via drill 0.61)  (1 unrouted)
  Top 0.254: C10.2 91.57,87.38 IC1.62
  Top 0.305: IC1.32 72.82,79.86 72.82,74.55 | 72.82,74.55 71.37,74.55 C11.2 | C1.2 76.98,66.8 76.71,66.8 76.71,65.41 72.14,65.41 72.14,66.93 C2.2 70.87,66.93 | 55.24,70.48 53.59,70.48 52.07,72.01 C4.2 C3.2 | 55.24,70.48 56.26,70.48 57.86,72.08 IC2.7 57.86,75.37 56.9,76.33 56.9,82.93 | 55.24,70.48 55.26,70.48 | 112.52,70.61 OK1.16 105.79,70.61 91.57,84.84 C10.2 | 112.52,78.23 OK1.13 | 112.52,80.77 OK1.12 | 112.52,88.39 OK1.9 | IC8.9 110.51,45.59 C21.2 110.62,44.58 111.12,44.07 117.35,44.07 | OK2.16 112.52,91.95 112.52,91.31 | OK2.13 112.52,99.57 112.52,98.81 | OK2.12 112.52,102.11 112.52,101.98 112.52,109.73 OK2.9 | C22.2 IC7.9 | 33.53,106.05 IC6.13 | 33.53,106.05 IC6.12 | 33.53,106.05 C24.2 34.16,104.89 | 27.05,64.01 IC5.4 | 27.05,64.01 IC5.5 IC5.12 37.21,64.01 | 27.05,64.01 C23.2 | 37.21,64.01 IC5.13 | 37.21,64.01 C20.2 38.48,64.01 38.48,67.69 41.15,70.36 43.31,70.36 | IC6.4 33.54,116.19 C25.2 33.54,116.22 IC6.5 32.26,112.52 44.83,112.52 44.83,104.89 35.18,104.89 | 34.16,104.89 35.18,104.89 | 35.18,104.89 35.05,104.89 | C22.2 28.34,104.89 34.16,104.89 | 60.45,67.56 57.21,67.56 IC2.21 | 60.45,67.56 IC2.26 | 56.9,82.93 56.9,84.09 59.44,86.61 C12.2 60.85,87.27 60.83,88.9 67.8,88.9 IC1.11 67.94,88.9 75.69,88.9 79.33,92.58 79.33,95.37 IC1.81 | 60.45,67.56 64.77,67.56 64.77,68.07 | 64.77,68.07 64.77,68.69 C5.2 | 70.87,66.93 69.47,66.93 64.77,66.93 64.77,68.07 | 72.82,74.55 70.87,74.55 70.87,66.93 | v33.02,31.88 C6.2 | 56.9,82.93 56.9,82.17 | IC1.81 79.32,100.33 80.01,100.96 C9.2 | IC1.81 79.33,95.77 | IC1.62 83.69,87.38 | C22.2 28.32,102.23 28.32,100.84 43.31,100.84 51.69,100.84 51.69,105.16 | 65.15,105.16 C8.2 | 51.69,105.16 65.15,105.16
  Top 0.305: 65.15,105.16 C7.1 | IC2.18 55.24,66.24 55.24,70.48 | 51.69,105.16 IC4.1 | 73.53,24 73.66,24.13
  Top 0.406: OK6.5 134,29.61 | 134,31.5 C19.2 | OK5.5 122.3,32 C18.2 | OK4.5 110.62,32 C17.2 | OK3.5 98.93,32 C16.2
  Top 0.61: 98.93,24 73.53,24 68.71,24 | 68.71,24 68.33,24 68.33,19.05 C15.2 C13.2 68.47,13.46 67.06,13.46 67.06,8.76 USB1.GND | 98.93,24 110.62,24 | 110.62,24 122.31,24 | 122.31,24 132.84,24 | 132.84,24 132.97,24 | 112.52,101.98 112.52,98.81 112.52,91.31 112.52,88.39 112.52,80.77 112.52,78.23 112.52,70.61 113.41,70.61 117.35,66.67 117.35,44.07 123.95,37.47 129.41,37.47 134,32.88 134,31.5 134,29.61 | v43.31,27.3 43.29,27.3 43.29,24 v51.82,24 | 56.9,82.17 v52.83,82.17 | v43.31,37.72 43.31,70.36 v43.31,82.17 43.31,100.84 | 98.93,24 OK3.5 | OK6.5 133.99,24 132.84,24 | 122.31,24 OK5.5 | 110.62,24 OK4.5 | 69.47,66.93 69.47,27.18 73.66,27.18 73.66,24.13 | v55.5,24 68.71,24
  Bottom 0.305: v33.02,31.88 43.31,31.88 43.31,32.13
  Bottom 0.61: v52.83,82.17 v43.31,82.17 | v43.31,37.72 43.31,32.13 v43.31,27.3 | v51.82,24 v55.5,24
  pour Bottom (isolate 0.61): 139.32,134.24 139.32,0.13 0.13,0.13 0.13,134.24
GNDA  (via drill 0.61)
  Top 0.305: IC1.99 70.32,95.8 70.32,97.83 68.96,99.19 v68.96,100.96 | v61.21,62.36 59.81,63.77 IC2.25 | C27.2 32.13,19.7 32.13,21.34 | IC3.12 32.13,21.34 | C26.2 32.13,19.57 32.13,21.34 | v49.91,62.36 49.91,36.96 39.88,26.92 v39.88,24.89 43.31,24.89
  Bottom 0.305: 32.13,24.89 IC3.12 | 32.13,24.89 23.37,24.89 23.37,15.75 22.73,15.11 IL1.1 | v39.88,24.89 32.13,24.89 | v68.96,100.96 86.61,100.96 93.85,93.73 93.85,78.87 77.47,62.36 v61.21,62.36 v49.91,62.36
GNDIO
  Bottom 1.93: 121.29,43.05 IC8.10 | 121.29,43.05 SO4.2 | 121.29,43.05 36.19,43.05 36.19,41.66
  Bottom 2.184: 21.84,51.18 LO3.2 7.11,51.18 7.11,77.09 | 21.84,51.18 21.84,42.16 36.19,42.16 36.19,41.66 F1.2A | 7.11,77.09 7.11,104.65 | 7.11,104.65 7.11,125.48 SO5.2 13.21,122.3 24.64,122.3 24.64,120.52 | 21.84,51.18 21.84,55.12 IC5.8 | IC5.1 28.32,77.09 7.11,77.09 | IC7.10 18.29,104.65 7.11,104.65 | 24.64,120.52 IC6.8 | IC6.1 42.42,120.52 24.64,120.52
ISP0  (via drill 0.61)
  Top 0.305: v67.31,73.15 R3.1 65.28,74.61 65.28,76.96 66.04,77.72 70.74,77.72 71.82,78.8 IC1.30 | v58.48,71.38 58.49,71.4 IC2.6
  Bottom 0.305: v58.48,71.38 62.61,71.37 64.39,73.15 v67.31,73.15
ISP1  (via drill 0.61)
  Top 0.305: IC1.20 67.85,84.4 66.33,84.4 65.91,83.95 64.26,83.95 63.63,83.31 63.63,81.53 v62.86,80.64 | v60.71,76.83 61.11,76.44 IC2.2
  Bottom 0.305: v60.71,76.83 60.71,78.49 v62.86,80.64
ISP2  (via drill 0.61)
  Top 0.305: v69.85,82.93 69.85,83.88 IC1.21 | IC2.10 55.88,73.45 v55.88,71.37
  Bottom 0.305: v69.85,82.93 66.8,82.93 65.53,81.66 65.53,77.34 62.61,74.42 60.07,74.42 57.02,71.37 v55.88,71.37
ISP3  (via drill 0.61)
  Top 0.305: v64.64,82.8 65.22,83.39 IC1.22 | IC2.9 56.56,73.52 v56.56,75.05
  Bottom 0.305: v56.56,75.05 61.85,75.06 64.64,77.85 v64.64,82.8
N$1
  Top 0.305: IC1.34 73.83,79.86 73.83,78.33 78.99,73.15 Q1.1 78.99,66.93 C1.1
N$2
  Top 0.305: IC1.33 73.33,79.87 73.33,78.22 74.17,77.34 Q1.2 74.17,67.06 C2.1
N$3
  Top 0.305: IC2.15 53.31,21.26 USB1.D+
N$4
  Top 0.305: IC2.16 53.96,22.59 USB1.D-
N$5
  Top 0.305: C3.1 54.61,67.96 IC2.17
N$6
  Top 0.305: R1.2 RXLED.A
N$7
  Top 0.305: R2.2 TXLED.A
N$8
  Top 0.406: 70.47,15.88 C13.1 70.47,15.67 PTC1.2 | 70.61,19.05 70.48,19.05 C15.1
  Top 0.61: 70.47,15.88 C15.1 | 70.48,19.05 L1.1
N$9
  Top 0.305: D16.CATHODE 133.79,13.14 127.89,7.24 SI1.16
  Top 0.406: OK6.4 133.79,21.78 D16.CATHODE
N$10
  Top 0.305: OK6.2 128.58,21.65 D15.ANODE | R11.1 128.65,19.49
  Top 0.406: 128.65,19.49 D15.ANODE
N$11
  Top 0.305: OK5.4 122.11,21.78 D14.CATHODE 122.11,12.89 SI1.12
N$12
  Top 0.305: OK5.2 116.9,21.65 D13.ANODE | R9.1 116.97,19.49
  Top 0.406: 116.97,19.49 D13.ANODE
N$13
  Top 0.305: OK6.1 126.68,21.65 D15.CATHODE 126.68,14.93 SI1.14
N$14  (via drill 0.61)
  Top 0.305: R5.2 93.6,13.59 v97.15,10.03
  Bottom 0.305: v97.15,10.03 102.49,4.7 SI1.1
N$15
  Top 0.305: OK5.3 120.21,21.52 D14.ANODE | R10.2 120.27,19.5
  Top 0.406: 120.27,19.5 D14.ANODE
N$16
  Top 0.305: OK3.1 91.63,21.65 D9.CATHODE 91.63,13.14 97.54,7.24 SI1.2
N$17
  Top 0.305: OK4.4 110.3,21.65 D12.CATHODE 110.3,8.96 111.38,7.87 SI1.8
N$18
  Top 0.305: OK4.2 105.22,21.65 D11.ANODE | R7.1 105.16,19.49
  Top 0.406: 105.16,19.49 D11.ANODE
N$19
  Top 0.305: OK3.4 98.61,21.65 D10.CATHODE 98.61,14.93 SI1.4
N$20
  Top 0.305: OK3.2 93.53,21.65 D9.ANODE | R5.1 93.6,19.49
  Top 0.406: 93.6,19.49 D9.ANODE
N$21
  Top 0.305: OK1.8 116.84,87.88 120.4,87.88 D4.CATHODE 120.14,87.94 120.14,87.88 121.67,87.88 122.81,89.03 SI2.8
N$22  (via drill 0.61)
  Top 0.305: OK1.5 116.71,81.15 120.78,81.15 | 120.78,81.15 v123.44,81.15 | D3.CATHODE 120.78,81.09 120.78,81.15
  Bottom 0.305: v123.44,81.15 128.78,86.49 SI2.6
N$23
  Top 0.305: 119.89,77.6 116.97,77.6 OK1.4 | 119.89,77.6 120.02,77.6 | SI2.4 129.67,83.95 123.32,77.6 120.52,77.6 | 119.89,77.6 120.52,77.6 | D2.CATHODE 120.52,77.66 120.52,77.6
N$24
  Top 0.305: OK1.1 116.59,70.87 120.4,70.87 D1.CATHODE 127.32,70.8 132.08,75.56 SI2.2
N$25
  Top 0.305: OK2.7 116.71,107.57 120.4,107.57 D8.ANODE 122.62,107.38 R15.1
N$26
  Top 0.305: OK2.6 116.71,104.27 120.02,104.27 120.02,104.33 D7.ANODE 120.4,104.39 R16.1
N$27
  Top 0.305: OK2.3 116.71,97.41 120.52,97.41 D6.ANODE 122.62,97.22 R17.1
N$28
  Top 0.305: OK2.2 116.71,94.11 120.52,94.11 D5.ANODE 122.62,94.04 R18.1
N$29
  Top 0.305: OK2.1 116.71,92.33 120.52,92.33 | SI2.10 122.43,91.57 121.67,92.33 120.52,92.33 | 120.52,92.33 120.14,92.33 | 120.52,92.33 D5.CATHODE
N$30  (via drill 0.61)
  Top 0.305: OK2.4 116.71,99.19 120.52,99.19 | 120.52,99.19 v123.44,99.19 | 120.52,99.19 D6.CATHODE
  Bottom 0.305: v123.44,99.19 128.52,94.11 SI2.12
N$31
  Top 0.305: OK2.5 116.71,102.49 120.4,102.49 | SI2.14 129.54,96.65 123.7,102.49 120.4,102.49 | 120.4,102.49 D7.CATHODE
N$32
  Top 0.305: OK2.8 116.71,109.35 120.4,109.35 | 120.4,109.35 D8.CATHODE | 120.4,109.35 127.25,109.35 132.08,104.52 SI2.16
N$33
  Top 0.305: OK1.7 116.59,86.11 R19.1 120.4,86.11 D4.ANODE
N$34
  Top 0.305: OK1.6 116.71,82.93 120.02,82.93 120.02,82.99 D3.ANODE 122.62,82.99 R20.1
N$35
  Top 0.305: OK1.3 116.46,75.82 120.4,75.82 D2.ANODE 122.62,75.76 R21.1
N$36
  Top 0.305: OK1.2 116.84,72.64 120.02,72.64 120.02,72.7 D1.ANODE 122.62,72.7 R22.1
N$37
  Top 0.305: L2.1 61.21,100.84 62.36,99.69 65.13,99.69 C8.1 65.17,99.69 67.56,99.69 69.82,97.44 IC1.100
N$38  (via drill 0.61)
  Top 0.305: R22.2 124.65,72.77 v127.25,72.77
  Bottom 0.305: v127.25,72.77 134.62,80.14 SI2.1
N$39
  Top 0.305: SI2.3 133.35,82.68 129.92,82.68 124.46,77.22 124.46,75.82 R21.2
N$40
  Top 0.305: R20.2 124.46,83.06 124.46,83.19 126.75,83.19 128.78,85.22 133.35,85.22 SI2.5
N$41
  Top 0.305: SI2.7 133.35,87.76 124.59,87.76 124.46,87.63 124.46,86.11 R19.2
N$42  (via drill 0.61)
  Top 0.305: v127.13,107.44 R15.2
  Bottom 0.305: v127.13,107.44 134.62,99.95 SI2.15
N$43
  Top 0.305: SI2.13 133.35,97.92 129.79,97.92 124.46,103.25 124.46,104.39 | 124.46,104.39 R16.2 124.46,104.39
N$44
  Top 0.305: SI2.11 133.35,95.38 128.52,95.38 126.62,97.28 R17.2
N$45
  Top 0.305: SI2.9 133.35,92.84 124.59,92.84 124.46,92.96 124.46,94.11 R18.2
N$46
  Top 0.305: R6.1 96.65,14.22 101.98,8.89 103.76,8.89 105.16,7.49 105.16,5.84 SI1.3
N$47  (via drill 0.61)
  Top 0.305: v105.16,12.95 R7.2
  Bottom 0.305: v105.16,12.95 105.16,10.16 107.44,7.87 107.44,6.1 SI1.5
N$48
  Top 0.305: R8.1 108.33,9.78 110.24,7.87 110.24,5.84 SI1.7
N$49
  Top 0.305: R9.2 116.97,9.52 115.32,7.87 115.32,6.1 SI1.9
N$50  (via drill 0.61)
  Top 0.305: v120.27,12.95 R10.1
  Bottom 0.305: SI1.11 117.86,6.1 117.86,7.87 120.27,10.29 v120.27,12.95
N$51
  Top 0.305: OK4.1 103.32,21.65 D11.CATHODE 103.32,12.76 SI1.6
N$52
  Top 0.305: R11.2 128.65,13.59 123.95,8.89 121.54,8.89 120.4,7.75 120.4,6.1 SI1.13
N$53  (via drill 0.61)
  Top 0.305: R12.1 131.95,13.72 v128.52,10.29
  Bottom 0.305: v128.52,10.29 122.94,4.7 SI1.15
N$54
  Bottom 1.93: IC8.11 SO3.1
N$55
  Top 0.305: OK6.3 131.89,21.52 D16.ANODE | R12.2 131.95,19.5
  Top 0.406: 131.95,19.5 D16.ANODE
N$56
  Bottom 1.93: IC8.12 SO3.2
N$57
  Bottom 1.93: IC8.13 SO3.3
N$58
  Bottom 1.93: SO3.4 IC8.14
N$59
  Bottom 1.93: SO3.5 IC8.15
N$60
  Bottom 1.93: IC8.16 SO3.6
N$61
  Bottom 1.93: IC8.17 SO3.7
N$62
  Bottom 1.93: IC8.18 SO3.8
N$63
  Bottom 2.184: SO1.4 IC7.14
N$64
  Bottom 2.184: SO1.3 IC7.13
N$65
  Bottom 2.184: SO1.2 IC7.12
N$66
  Bottom 2.184: SO1.1 IC7.11
N$67
  Bottom 2.184: LO2.1 25.27,73.79 25.27,70.23 28.32,70.23 IC5.2
N$68
  Bottom 2.184: LO2.2 21.72,69.98 21.72,57.66 IC5.7
N$69
  Top 2.184: IC5.9 35.94,52.45 21.84,52.45 21.84,59.05 11.43,59.05 11.43,66.17 LO2.3
N$70
  Top 2.184: LO2.4 15.88,62.48 19.3,62.48 19.3,77.09 35.94,77.09 IC5.16
N$71
  Top 2.184: LO1.1 18.54,119.76 18.54,120.52 28.7,120.52 | 28.7,120.52 28.96,120.52 | 28.7,120.52 39.88,120.52 IC6.2
N$72
  Top 2.184: LO1.2 20.57,115.95 20.57,117.6 27.18,117.6 IC6.7
N$73
  Bottom 2.184: LO1.3 15.75,112.27 19.43,112.27 19.43,110.87 24.64,110.87 IC6.9
N$74
  Top 2.184: LO1.4 20.95,108.33 20.95,110.87 42.42,110.87 IC6.16
N$75
  Bottom 2.184: SO2.1 IC7.15
N$76
  Bottom 2.184: SO2.2 IC7.16
N$77
  Bottom 2.184: SO2.3 IC7.17
N$78
  Bottom 2.184: SO2.4 IC7.18
N$79
  Top 0.305: IC3.10 27.05,17.91 27.81,17.14 IL1.3
N$80
  Bottom 0.305: IC3.14 37.21,17.14 36.32,16.26 26.16,16.26 25.27,15.37 IL1.2
N$81
  Top 2.184: 15.37,19.68 15.36,16.89 CON1.GND1 | 15.37,19.68 F1.1A | CON1.GND2 15.37,13.08 15.37,19.68
N$83
  Top 0.305: OK5.1 115,21.65 D13.CATHODE 115,9.08 113.92,8 SI1.10
N$84
  Top 0.305: OK4.3 108.4,21.52 D12.ANODE | R8.2 108.33,19.49
  Top 0.406: 108.33,19.49 D12.ANODE
N$85
  Bottom 2.184: 36.19,39.62 36.19,44.58
N$86
  Top 2.184: 15.37,39.75 15.37,44.7
N$102  (via drill 0.61)
  Top 0.406: OK4.8 103,32 C16.1 | OK6.8 126.36,32 C18.1 | OK5.8 114.68,32 C17.1 | v136,27.05 C19.1
  Bottom 0.406: 126.36,27.05 v136,27.05
  Bottom 0.61: Q2.2 83.06,27.05 91.31,27.05 | 91.31,27.05 OK3.8 | 91.31,27.05 103,27.05 | 103,27.05 OK4.8 | 114.68,27.05 126.36,27.05 OK6.8 | 103,27.05 114.68,27.05 | 114.68,27.05 OK5.8
N$103
  Top 0.406: USB1.VBUS 68.31,10.73 PTC1.1
N$105
  Top 0.305: OK3.3 96.71,21.65 D10.ANODE | R6.2 96.65,19.49
  Top 0.406: 96.65,19.49 D10.ANODE
OCX0  (via drill 0.61)
  Top 0.305: IC1.25 67.83,81.89 70.75,81.89 74.93,86.11 v79.5,86.11
  Bottom 0.305: v79.5,86.11 79.5,74.93 77.22,72.64 77.22,68.45 74.55,65.79 37.85,65.91 37.21,66.55 33.02,66.55 31.75,67.82 IC5.3
OCX1  (via drill 0.61)
  Top 0.305: IC1.26 69.82,81.41 71.76,81.41 75.31,84.96 v81.66,84.96
  Bottom 0.305: v81.66,84.96 81.66,68.83 76.33,63.63 44.45,63.63 39.75,58.93 32.51,58.93 31.24,60.2 IC5.6
OCX2  (via drill 0.61)
  Top 0.305: IC1.6 75.75,91.38 v76.33,90.8
  Bottom 0.305: v76.33,90.8 80.64,86.49 80.64,69.85 75.31,64.64 43.18,64.64 38.73,60.2 IC5.11
OCX3  (via drill 0.61)
  Top 0.305: IC1.7 73.83,90.88 v74.55,90.17
  Bottom 0.305: v74.55,90.17 78.36,86.36 78.36,75.82 75.82,73.28 75.82,68.83 73.79,66.8 39.37,66.8 38.35,67.82 IC5.14
OCX4  (via drill 0.61)
  Top 0.305: IC1.16 72.54,86.38 v73.28,87.12
  Bottom 0.305: v73.28,87.12 73.28,90.55 28.83,90.55 27.81,89.53 IC7.4
OCX5  (via drill 0.61)
  Top 0.305: IC1.17 71.6,85.88 v72.14,85.47
  Bottom 0.305: v72.14,85.47 72.14,90.04 30.73,90.04 27.69,86.99 IC7.3
OCX6  (via drill 0.61)
  Top 0.305: IC1.39 76.32,83.56 v75.95,83.95
  Bottom 0.305: v75.95,83.95 72.26,83.95 71.12,85.09 71.12,89.53 32.77,89.53 27.69,84.45 IC7.2
OCX7  (via drill 0.61)
  Top 0.305: IC1.40 76.83,82.17 v77.34,82.8
  Bottom 0.305: v77.34,82.8 72.39,82.8 70.61,84.58 70.61,89.03 34.67,89.03 27.56,81.91 IC7.1
PA0  (via drill 0.61)
  Top 0.305: IC1.78 80.82,97.2 82.04,98.42 84.96,98.42 v85.98,99.44
  Bottom 0.305: 40,107.82 40,107.31 | 40,107.82 40,112.27 IC6.3 | v85.98,99.44 47.5,99.44 40,106.93 40,107.82
PA1  (via drill 0.61)
  Top 0.305: IC1.77 81.32,97.07 82.17,97.92 v85.98,97.92
  Bottom 0.305: v85.98,97.92 87.12,96.77 87.12,96.01 86.61,95.5 85.34,95.5 84.33,96.52 45.59,96.52 36.07,106.05 36.07,108.84 33.66,111.38 31.37,111.38 29.72,113.03 IC6.6
PA2  (via drill 0.61)
  Top 0.305: IC1.76 81.83,96.77 82.45,97.41 83.06,97.41 83.82,96.65 v83.82,95.38
  Bottom 0.305: v83.82,95.38 83.57,95.12 41.91,95.12 IC6.11
PA3  (via drill 0.61)
  Top 0.305: IC1.75 86.64,93.88 87.12,94.36 87.12,95.5 86.11,96.52 v85.98,96.52
  Bottom 0.305: v85.98,96.52 84.45,97.92 46.74,97.92 IC6.14
PA4  (via drill 0.61)
  Top 0.305: IC1.74 83.92,93.39 87.52,93.39 v88.14,93.98
  Bottom 0.305: v88.14,93.98 87.5,93.34 34.54,93.34 27.69,99.69 IC7.8
PA5  (via drill 0.61)
  Top 0.305: IC1.73 83.92,92.89 88.95,92.89 v89.54,93.47
  Bottom 0.305: v89.54,93.47 88.9,92.84 32.13,92.84 27.56,97.16 IC7.7
PA6  (via drill 0.61)
  Top 0.305: IC1.72 83.88,92.4 90.51,92.39 v91.06,92.96
  Bottom 0.305: v91.06,92.96 90.42,92.33 29.84,92.33 27.56,94.61 IC7.6
PA7  (via drill 0.61)
  Top 0.305: IC1.71 92.01,91.88 v92.58,92.46
  Bottom 0.305: v92.58,92.46 91.95,91.82 28.07,91.82 27.81,92.08 IC7.5
PC0
  Top 0.305: IC8.8 110.11,51.69 110.11,53.59 | 110.11,53.59 110.11,52.32 | 110.11,53.59 110.11,58.42 85.65,82.89 83.75,82.89 IC1.53
PC1
  Top 0.305: IC8.7 110.62,53.72 110.62,55.63 | 110.62,55.63 110.62,55.12 | 110.62,55.63 110.62,58.55 85.82,83.39 83.79,83.39 IC1.54
PC2
  Top 0.305: IC8.6 111.12,55.75 111.12,58.67 85.96,83.89 83.8,83.89 IC1.55
PC3
  Top 0.305: IC8.5 111.63,57.78 111.63,58.8 86.11,84.4 83.83,84.4 IC1.56
PC4
  Top 0.305: IC1.57 83.85,84.88 86.39,84.88 112.9,58.29 IC8.4
PC5
  Top 0.305: IC1.58 83.8,85.36 86.6,85.36 111.12,60.83 IC8.3
PC6
  Top 0.305: IC8.2 109.35,63.37 86.87,85.89 IC1.59
PC7
  Top 0.305: IC1.60 87.1,86.38 107.57,65.91 IC8.1
PD0
  Top 0.305: IC1.43 78.33,79.94 78.33,77.88 93.85,62.36 OK3.7
PD1
  Top 0.305: IC1.44 78.82,79.86 78.82,78.08 96.39,60.5 OK3.6
PD2
  Top 0.305: IC1.45 79.32,79.87 79.32,78.28 99.44,58.17 99.44,50.8 105.54,44.7 OK4.7
PD3
  Top 0.305: OK4.6 108.08,42.8 99.95,50.93 99.95,58.29 79.83,78.42 79.83,79.87 IC1.46
PD4
  Top 0.305: IC1.47 80.31,78.56 100.46,58.42 100.46,51.05 110.11,41.4 116.2,41.4 117.22,40.39 OK5.7
PD5
  Top 0.305: OK5.6 119.76,38.48 116.33,41.91 110.24,41.91 100.96,51.18 100.96,58.55 80.82,78.69 80.82,79.86 IC1.48
PD6
  Top 0.305: OK6.7 128.9,34.42 127.51,35.81 123.06,35.81 116.46,42.42 110.36,42.42 101.47,51.31 101.47,58.67 81.32,78.83 81.32,79.87 IC1.49
PD7
  Top 0.305: OK6.6 131.44,32.51 127.64,36.32 123.19,36.32 116.59,42.93 110.49,42.93 101.98,51.44 101.98,58.8 81.82,78.96 IC1.50
PE1
  Top 0.305: 67.82,92.84 IC1.3 67.73,92.89 66.08,92.89 65.66,92.46 57.53,92.46 45.72,80.64 45.72,36.58 42.8,33.66 27.05,33.66 IC3.5
PE2
  Top 0.305: 67.82,92.33 IC1.4 67.75,92.38 66.22,92.38 65.79,91.95 57.66,91.95 46.23,80.52 46.23,36.45 42.93,33.15 29.59,33.15 IC3.4
PE3
  Top 0.305: IC3.3 32.13,27.18 37.59,27.18 46.74,36.32 46.74,80.39 57.78,91.44 65.91,91.44 66.37,91.89 67.89,91.89 IC1.5
PE6
  Top 0.305: 67.82,90.42 IC1.8 67.74,90.38 66.34,90.38 65.79,90.93 57.91,90.93 47.24,80.26 47.24,36.19 37.72,26.67 20.57,26.67 20.57,19.81 24.51,19.81 IC3.9
PE7
  Top 0.305: 67.82,89.92 IC1.9 67.71,89.88 66.18,89.88 65.66,90.42 58.04,90.42 47.75,80.14 47.75,36.07 37.85,26.16 21.97,26.16 IC3.8
PH0
  Top 0.305: IC1.12 62.35,88.38 61.72,87.76 61.72,73.51 IC2.1
PH1  (via drill 0.61)
  Top 0.305: v57.91,76.83 59.16,75.59 IC2.5 | v62.86,87.38 63.37,87.88 IC1.13
  Bottom 0.305: v62.86,87.38 64.52,85.72 64.52,84.96 57.91,78.36 v57.91,76.83
PH2  (via drill 0.61)
  Top 0.305: v62.74,81.91 62.74,84.33 62.48,84.58 62.48,85.6 64.27,87.38 IC1.14 | v59.31,76.83 60.46,75.69 IC2.3
  Bottom 0.305: v62.74,81.91 59.31,78.49 v59.31,76.83
PH3  (via drill 0.61)
  Top 0.305: v63.5,85.22 65.15,86.87 67.82,86.87 IC1.15 | 55.26,76.95 v55.24,76.96 55.24,73.49 IC2.11
  Bottom 0.305: v55.24,76.96 v63.5,85.22
PJ0
  Top 0.305: OK1.15 103.89,73.15 92.71,84.33 92.71,87.12 91.95,87.87 IC1.63
PJ1
  Top 0.305: OK1.14 101.98,75.69 93.22,84.45 93.22,87.25 92.08,88.38 IC1.64
PJ2
  Top 0.305: OK1.11 95,83.31 93.73,84.58 93.73,87.38 92.22,88.89 83.83,88.89 IC1.65
PJ3
  Top 0.305: OK1.10 95.89,85.85 92.34,89.38 83.83,89.38 IC1.66
PJ4
  Top 0.305: IC1.67 83.83,89.89 96.66,89.89 101.22,94.49 OK2.15
PJ5
  Top 0.305: OK2.14 103.12,97.03 96.52,90.38 83.84,90.39 IC1.68
PJ6
  Top 0.305: OK2.11 106.93,104.65 102.87,100.58 102.87,97.41 96.39,90.88 83.84,90.87 IC1.69
PJ7
  Top 0.305: OK2.10 92.08,107.19 83.82,98.93 81.53,98.93 80.33,97.66 80.33,95.88 IC1.79
PL7
  Top 0.305: IC1.42 77.81,79.81 77.81,77.66 85.6,69.98 Q2.1
PWREN  (via drill 0.61)
  Top 0.305: 53.34,74.93 v53.34,75.95 | v63.5,78.61 63.5,79.25 66.69,82.39 67.83,82.39 IC1.24 | 53.34,74.93 R4.1 | 53.34,74.93 53.31,74.84 IC2.14
  Bottom 0.305: v53.34,75.95 61.34,75.95 63.5,78.1 v63.5,78.61
RESET  (1 unrouted)
  Top 0.305: 55.88,66.29 55.88,68.71 56.39,69.21 59.44,69.21 62.48,72.26 62.48,78.87 66.56,82.87 67.83,82.87 IC1.23 | R14.2 55.24,64.77 55.91,65.43 IC2.19
RXLED
  Top 0.305: RXLED.K 57.91,59.31 57.86,65.86 IC2.22
TXLED
  Top 0.305: TXLED.K 58.51,63.16 IC2.23
VCC  (via drill 0.61)  (1 unrouted)
  Top 0.305: IC1.31 72.32,76.56 C11.1 68.83,76.56 | 56.52,52.32 56.01,52.83 | 56.52,52.32 57.47,52.32 R1.1 R2.1 62.74,25.65 L1.2 | R14.1 55.22,60.9 55.22,53.61 56.52,52.32 | 68.83,76.56 68.83,69.47 68.2,68.83 66.8,68.83 66.79,69.07 C5.1 66.8,70.1 63.37,70.1 61.59,68.33 v56.77,68.33 56.56,68.11 IC2.20 | 68.83,76.56 69.09,76.58 67.56,76.58 R3.2 | IC1.10 67.8,89.41 | IC1.10 67.69,89.41 | 48.95,74.42 C4.1 48.89,72.01 v48.89,69.21 | 48.95,74.42 R4.2 | IC2.4 59.82,70.87 59.31,70.36 v57.53,70.36 | 58.79,89.38 C12.1 | 58.79,89.38 IC1.10 | 58.79,89.38 58.69,89.28 57.53,89.28 48.95,80.7 48.95,74.42 | C22.1 31.77,102.22 31.75,102.87 33.51,102.87 C24.1 45.61,102.89 45.72,103 45.72,113.16 | C25.1 35.54,116.73 36.07,116.2 36.07,113.92 36.83,113.16 45.72,113.16 | C23.1 24.02,62.59 25.15,61.47 38.99,61.47 40.26,62.74 40.26,63.9 C20.1 40.37,67.42 v42.16,69.21 | 57.66,106.55 54.71,106.55 54.71,112.14 53.72,113.16 45.72,113.16 | IC3.1 C6.1 | C9.1 83.42,99.57 81.53,99.57 79.82,97.85 IC1.80 79.83,95.52 79.83,89.29 82.17,86.87 83.69,86.87 IC1.61 87.49,86.88 88.52,85.85 C10.1 89.54,85.45 89.54,84.71 106.43,67.82 114.55,67.82 116.33,66.04 116.33,47.88 115.32,46.86 112.65,46.86 111.52,47.99 C21.1 110.09,48.01 109.09,48.01 109.09,45.34 110.87,43.56 116.84,43.56 123.57,36.83 128.52,36.83 132.59,32.77 v132.59,25.65 | v61.21,103.76 44.58,87.12 v44.58,69.21 | 57.66,106.55 R13.2 | L2.2 57.66,106.55
  Top 0.61: v44.58,37.72 v44.58,69.21
  Bottom 0.305: 56.77,69.21 56.77,69.6 | v44.58,69.21 v42.16,69.21 | IC3.1 37.21,25.78 44.58,25.78 L1.2 | v61.21,103.76 L2.2 49.4,106.55 49.4,122.55 67.69,122.55 67.69,129.41 AI1.10 70.23,129.41 70.23,122.55 131.44,122.55 131.44,129.41 AI2.10 | v132.59,25.65 75.82,25.65
  Bottom 0.61: v56.77,68.33 56.77,69.21 v48.89,69.21 v44.58,69.21 | 56.77,69.6 v57.53,70.36 | v44.58,37.72 44.58,25.65 L1.2 75.82,25.65 75.82,21.84 Q2.3
VCC/2
  Top 2.184: SO5.1 7.11,127.89 7.11,54.99 LO3.1 6.98,54.99 6.98,20.7 CON1.VCC
  Bottom 2.184: CON1.VCC 9.52,35.18 40.77,35.18 40.77,40.51 SO4.1
VREF  (via drill 0.61)
  Top 0.305: IC1.98 70.81,95.92 70.81,98.13 70.21,98.69 C7.2 70.23,104.28 70.23,106.3 68.01,108.52 R13.1 | v48.77,61.21 48.77,36.45 37.97,25.65 34.67,25.65 | 34.67,25.65 29.59,25.65 IC3.11 29.59,20.32 29.23,19.96 C26.1 29.23,17.26 30.35,16.13 IL1.4 | 34.67,25.65 IC3.13 34.67,20.32 35.18,19.81 C27.1 | v57.66,110.11 R13.1 | R13.1 57.6,108.46
  Bottom 0.305: 69.6,110.11 78.49,110.11 83.25,105.35 | 69.6,110.11 68.83,110.11 58.17,110.11 | 58.17,110.11 v57.66,110.11 | 83.25,105.35 94.61,93.98 94.61,78.61 77.34,61.21 v48.77,61.21 | 58.17,110.11 IC4.2 | 69.6,110.11 68.96,110.11 | 132.71,113.28 91.19,113.28 83.25,105.35
  Bottom 0.406: 132.71,113.28 AI2.9 | AI1.9 68.96,110.11 68.83,110.11

### Text on the board
Top: F 1.5A
Bottom: X0 | X1 | X2 | X3 | X4 | X5 | X6 | X7 | -+ | AN IN-1 | AN IN-2 | DIG IN-2 | DIG OUT-1 | PWM OUT | DIG OUT-2 | - + | +- | USB MERICI DESKA v1.1 | EXT PWR | 30V/1.5A | DIG IN-1 | Vojta Molda | AN OUT | USB
dxf: Analogove vstupy 0-7 | Analogove vstupy 8-15 | Stinene | Stinene | Nestinene | Nestinene | Zatez | 1.5 A | vystupy 1 | Digitalni | Digitalni vstupy 2 | 500 mA | 500 mA | PWM vystupy | 1.5 A | vystupy 2 | Digitalni | Zatez | Zatez | Externi zdroj | Analogove | Digitalni vstupy 1 | vystupy | USB